# Altium project RK3568_train.PrjPcb (part 2 of 6)

## Sheet RK809-5.schdoc: =
size A3; Symbol: Sheet-Symbol_A4; Company: 嘉立创EDA; Version: V1.0; Page Size: A4; @Project Name: RK3568B2地瓜派; @Page Count: 27; @Update Date: 2025-09-11; @Create Date: 2025-09-11; @Schematic Name: Schematic1; @Page No: 14; @Page Name: RK809-5; Device: Sheet-Symbol_A4; Border: 1; Title Block Position: 3; Width: 1655; Height: 1170; Region Start: 1; X Region Count: 6; Y Region Count: 4; Blade Width: 10; @Board Name: Board1; @Create Time: 22:14:45; @Update Time: 22:15:05; Organization: ORGANIZATION; Address1: ADDRESS 1; Address2: ADDRESS 2; Address3: ADDRESS 3; Address4: ADDRESS 4; Revision: V1.0.0; SheetNumber: 6; SheetTotal: 28
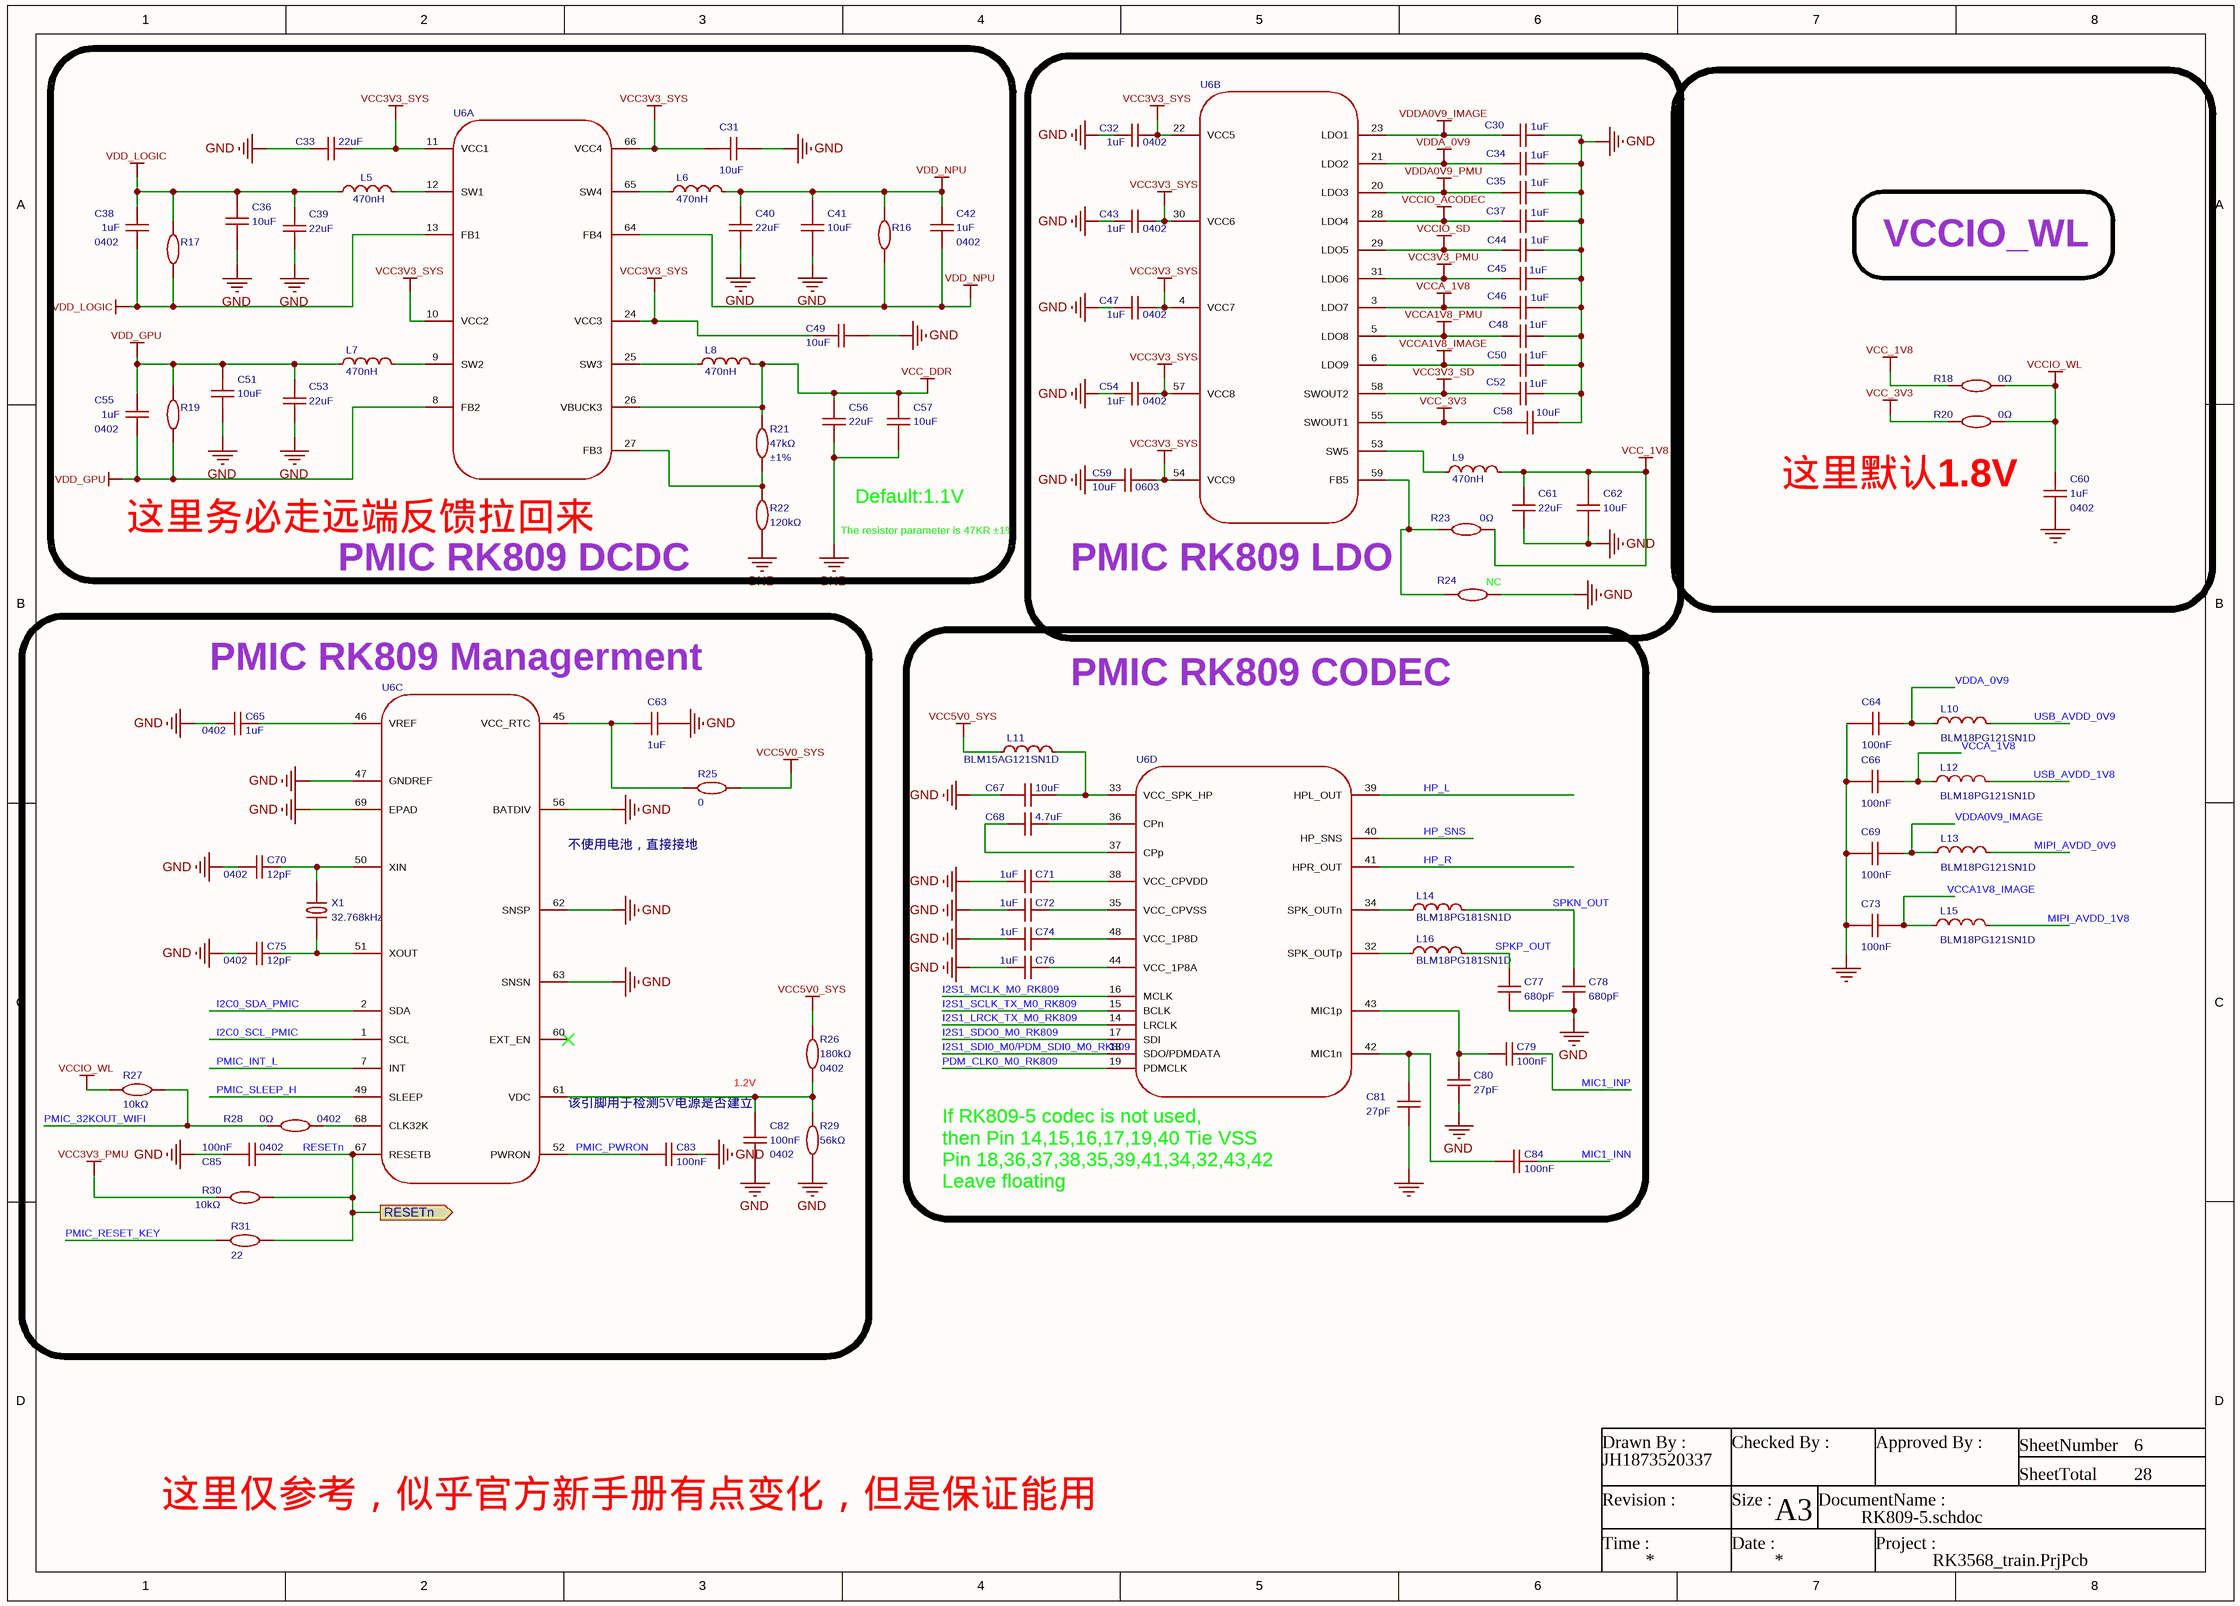
[diagram p5: RK809-5.schdoc]

### Parts
C30  1uF  [MYC0402]
C31  10uF  [C0603]
C32  1uF  Supplier Footprint: 0402  [MYC0402]
C33  22uF  [C0603]
C34  1uF  [MYC0402]
C35  1uF  [MYC0402]
C36  10uF  [C0603]
C37  1uF  [MYC0402]
C38  1uF  Supplier Footprint: 0402  [MYC0402]
C39  22uF  [C0603]
C40  22uF  [C0603]
C41  10uF  [C0603]
C42  1uF  Supplier Footprint: 0402  [MYC0402]
C43  1uF  Supplier Footprint: 0402  [MYC0402]
C44  1uF  [MYC0402]
C45  1uF  [MYC0402]
C46  1uF  [MYC0402]
C47  1uF  Supplier Footprint: 0402  [MYC0402]
C48  1uF  [MYC0402]
C49  10uF  [C0603]
C50  1uF  [MYC0402]
C51  10uF  [C0603]
C52  1uF  [MYC0402]
C53  22uF  [C0603]
C54  1uF  Supplier Footprint: 0402  [MYC0402]
C55  1uF  Supplier Footprint: 0402  [MYC0402]
C56  22uF  [C0603]
C57  10uF  [C0603]
C58  10uF  [C0603]
C59  10uF  Supplier Footprint: 0603  [C0603]
C60  1uF  Supplier Footprint: 0402  [MYC0402]
C61  22uF  [C0603]
C62  10uF  [C0603]
C63  1uF  [MYC0402]
C64  100nF  [MYC0402]
C65  1uF  Supplier Footprint: 0402  [MYC0402]
C66  100nF  [MYC0402]
C67  10uF  [MYC0402]
C68  4.7uF  [MYC0402]
C69  100nF  [MYC0402]
C70  12pF  Supplier Footprint: 0402  [MYC0402]
C71  1uF  [MYC0402]
C72  1uF  [MYC0402]
C73  100nF  [MYC0402]
C74  1uF  [MYC0402]
C75  12pF  Supplier Footprint: 0402  [MYC0402]
C76  1uF  [MYC0402]
C77  680pF  [R0402]
C78  680pF  [R0402]
C79  100nF  [MYC0402]
C80  27pF  [R0402]
C81  27pF  [R0402]
C82  100nF  Supplier Footprint: 0402  [MYC0402]
C83  100nF  [MYC0402]
C84  100nF  [MYC0402]
C85  100nF  Supplier Footprint: 0402  [MYC0402]
L5  470nH  [IND-SMD_L2.0-W1.6_MHCHL201610A-1R0M-Q8A]
L6  470nH  [IND-SMD_L2.0-W1.6_MHCHL201610A-1R0M-Q8A]
L7  470nH  [IND-SMD_L2.0-W1.6_MHCHL201610A-1R0M-Q8A]
L8  470nH  [IND-SMD_L2.0-W1.6_MHCHL201610A-1R0M-Q8A]
L9  470nH  [IND-SMD_L2.0-W1.6_MHCHL201610A-1R0M-Q8A]
L10  BLM18PG121SN1D  [L0603]
L11  BLM15AG121SN1D  [L0402]
L12  BLM18PG121SN1D  [L0603]
L13  BLM18PG121SN1D  [L0603]
L14  BLM18PG181SN1D  [L0603]
L15  BLM18PG121SN1D  [L0603]
L16  BLM18PG181SN1D  [L0603]
R16  0402WGF1000TCE  [R0402]  (value not drawn)
R17  0402WGF1000TCE  [R0402]  (value not drawn)
R18  0Ω  [R0402]
R19  0402WGF1000TCE  [R0402]  (value not drawn)
R20  0Ω  [R0402]  (no BOM)
R21  47kΩ  Tolerance: ±1%  [R0402]
R22  120kΩ  [R0402]
R23  0Ω  [R0402]
R24  NC  [R0402]  (no BOM)
R25  0  [R0402]
R26  180kΩ  Supplier Footprint: 0402  [R0402]
R27  10kΩ  [R0402]
R28  0Ω  Supplier Footprint: 0402  [R0402]
R29  56kΩ  [R0402]
R30  10kΩ  [R0402]
R31  22  [R0402]
U6  (no value)  [RK809-5]  (parts A,B,C,D of 4)
X1  32.768kHz  [CRYSTAL-SMD_L3.2-W1.5-1]

### Blocks framed on the sheet
PMIC RK809 LDO: C30 C32 C34 C35 C37 C43-C48 C50 C52 C54 C58 C59 C61 C62 L9 R23 R24 U6
PMIC RK809 Managerment: C63 C65 C70 C75 C82 C83 C85 R25-R31 U6 X1
PMIC RK809 CODEC: C67 C68 C71 C72 C74 C76-C81 C84 L11 L14 L16 U6

### Ports
RESETn (out)

### Nets
GND: C30.2 C31.2 C32.1 C33.1 C34.2 C35.2 C36.1 C37.2 C39.2 C40.2 C41.1 C43.1 C44.2 C45.2 C46.2 C47.1 C48.2 C49.1 C50.2 C51.1 C52.2 C53.2 C54.1 C56.2 C57.1 C58.2 C59.1 C60.1 C61.2 C62.1 C63.2 C64.1 C65.1 C66.1 C67.1 C69.1 C70.1 C71.1 C72.1 C73.1 C74.1 C75.2 C76.1 C77.1 C78.1 C80.1 C81.1 C82.1 C83.2 C85.1 R22.1 R24.2 R29.1 U6.47(GNDREF) U6.56(BATDIV) U6.62(SNSP) U6.63(SNSN) U6.69(EPAD)
MIPI_AVDD_0V9: L13.2
MIPI_AVDD_1V8: L15.2
USB_AVDD_0V9: L10.2
USB_AVDD_1V8: L12.2
VCC3V3_PMU: C45.1 R30.1 U6.31(LDO6)
VCC3V3_SD: C52.1 U6.58(SWOUT2)
VCC3V3_SYS: C31.1 C32.2 C33.2 C43.2 C47.2 C49.2 C54.2 C59.2 U6.4(VCC7) U6.10(VCC2) U6.11(VCC1) U6.22(VCC5) U6.24(VCC3) U6.30(VCC6) U6.54(VCC9) U6.57(VCC8) U6.66(VCC4)
VCC5V0_SYS: L11.1 R25.2 R26.2
VCC_1V8: C61.1 C62.2 L9.2 R18.1 R23.2  [project net LCD_1V8]
VCC_3V3: C58.1 R20.1 U6.55(SWOUT1)  [project net TP_3V3]
VCC_DDR: C56.1 C57.2 L8.2 R21.1 U6.26(VBUCK3)
VCCA1V8_IMAGE: C50.1 C73.2 L15.1 U6.6(LDO9)
VCCA1V8_PMU: C48.1 U6.5(LDO8)
VCCA_1V8: C46.1 C66.2 L12.1 U6.3(LDO7)
VCCIO_ACODEC: C37.1 U6.28(LDO4)
VCCIO_SD: C44.1 U6.29(LDO5)
VCCIO_WL: C60.2 R18.2 R20.2 R27.1
VDD_GPU: C51.2 C53.1 C55.1 C55.2 L7.1 R19.1 R19.2 U6.8(FB2)
VDD_LOGIC: C36.2 C38.1 C38.2 C39.1 L5.1 R17.1 R17.2 U6.13(FB1)
VDD_NPU: C40.1 C41.2 C42.1 C42.2 L6.2 R16.1 R16.2 U6.64(FB4)
VDDA0V9_IMAGE: C30.1 C69.2 L13.1 U6.23(LDO1)
VDDA0V9_PMU: C35.1 U6.20(LDO3)
VDDA_0V9: C34.1 C64.2 L10.1 U6.21(LDO2)
HP_L: U6.39(HPL_OUT)
HP_R: U6.41(HPR_OUT)
HP_SNS: U6.40(HP_SNS)
I2C0_SCL_PMIC: U6.1(SCL)
I2C0_SDA_PMIC: U6.2(SDA)
I2S1_LRCK_TX_M0_RK809: U6.14(LRCLK)
I2S1_MCLK_M0_RK809: U6.16(MCLK)
I2S1_SCLK_TX_M0_RK809: U6.15(BCLK)
I2S1_SDI0_M0/PDM_SDI0_M0_RK809: U6.18(SDO/PDMDATA)
I2S1_SDO0_M0_RK809: U6.17(SDI)
MIC1_INN: C84.2
MIC1_INP: C79.2
PDM_CLK0_M0_RK809: U6.19(PDMCLK)
PMIC_32KOUT_WIFI: R27.2 R28.1
PMIC_INT_L: U6.7(INT)
PMIC_PWRON: C83.1 U6.52(PWRON)
PMIC_RESET_KEY: R31.1
PMIC_SLEEP_H: U6.49(SLEEP)
RESETn: C85.2 R30.2 R31.2 U6.67(RESETB) ; port RESETn
SPKN_OUT: C78.2 L14.2
SPKP_OUT: C77.2 L16.2
NetC63_1: C63.1 R25.1 U6.45(VCC_RTC)
NetC65_2: C65.2 U6.46(VREF)
NetC67_2: C67.2 L11.2 U6.33(VCC_SPK_HP)
NetC68_1: C68.1 U6.36(CPn)
NetC68_2: C68.2 U6.37(CPp)
NetC70_2: C70.2 U6.50(XIN) X1.2
NetC71_2: C71.2 U6.38(VCC_CPVDD)
NetC72_2: C72.2 U6.35(VCC_CPVSS)
NetC74_2: C74.2 U6.48(VCC_1P8D)
NetC75_1: C75.1 U6.51(XOUT) X1.1
NetC76_2: C76.2 U6.44(VCC_1P8A)
NetC79_1: C79.1 C80.2 U6.43(MIC1p)
NetC81_2: C81.2 C84.1 U6.42(MIC1n)
NetC82_2: C82.2 R26.1 R29.2 U6.61(VDC)
NetL5_2: L5.2 U6.12(SW1)
NetL6_1: L6.1 U6.65(SW4)
NetL7_2: L7.2 U6.9(SW2)
NetL8_1: L8.1 U6.25(SW3)
NetL9_1: L9.1 U6.53(SW5)
NetL14_1: L14.1 U6.34(SPK_OUTn)
NetL16_1: L16.1 U6.32(SPK_OUTp)
NetR21_2: R21.2 R22.2 U6.27(FB3)
NetR23_1: R23.1 R24.1 U6.59(FB5)
NetR28_2: R28.2 U6.68(CLK32K)

Not connected (* = marked no-connect by the designer): U6 60(EXT_EN)*

### Notes on the sheet
- VCCIO_WL
- 这里默认1.8V
- (near U6) 这里务必走远端反馈拉回来
- The resistor parameter is 47KR ±1%
- Default:1.1V
- PMIC RK809 DCDC
- (near U6) 不使用电池，直接接地
- 该引脚用于检测5V电源是否建立
- (near C82) 1.2V
- If RK809-5 codec is not used,
  then Pin 14,15,16,17,19,40 Tie VSS
  Pin 18,36,37,38,35,39,41,34,32,43,42
  Leave floating
- 这里仅参考，似乎官方新手册有点变化，但是保证能用
- Drawn By :
- Checked By :
- Approved By :
- SheetNumber
- SheetTotal
- Revision :
- Time :
- Size :
- Date :
- A3
- DocumentName :
- Project :

### Library data of the parts
C30 C32 C34 C35 C37 C38 C42-C48 C50 C52 C54 C55 C60 C63 C65 C71 C72 C74 C76 = CL05A105KP5NNNC: 容值:1uF;精度:±10%;额定电压:10V;材质(温度系数):X5R;; Manufacturer: SAMSUNG(三星); AddInBom: yes; ModelId: 36a51122f27c49738f86b3bfa98863e0; ModelName: C0402_L1.0-W0.5-H0.5; ModelTransform: 39.37,19.685,0,0,0,0,0,0,0; Tolerance: ±10%; Voltage Rated: 10V; Temperature Coefficient: X5R; Device: CL05A105KP5NNNC; Symbol: CL05A105KP5NNNC; LCSC Part Name: 1uF ±10% 10V; SupplierPart: C14445; ManufacturerPart: CL05A105KP5NNNC; JLCPCB Part Class: 扩展库; Datasheet: https://atta.szlcsc.com/upload/public/pdf/source/20160103/1457707670698.pdf; Supplier: LCSC; ConvertToPcb: yes; FootprintName: MYC0402; Value: 1uF
  C30 C34 C35 C37 C44-C46 C48 C50 C52 C63 C71 C72 C74 C76: Supplier Footprint: 0402
C31 = CAP_0603: as C4 on sheet DCDC; Device: CAP_0603; Value: 10uF; AddInBom: yes; Supplier Footprint: 0603; FootprintName: C0603
C33 C39 C40 C53 C56 C61 = CL10A226MQ8NRNC: as C25 on sheet DCDC; Supplier Footprint: 0603; Device: CL10A226MQ8NRNC; LCSC Part Name: 22uF ±20% 6.3V; SupplierPart: C59461; ManufacturerPart: CL10A226MQ8NRNC; JLCPCB Part Class: Basic Part; Datasheet: https://atta.szlcsc.com/upload/public/pdf/source/20160218/1457707763339.pdf; Supplier: LCSC; ConvertToPcb: yes; FootprintName: C0603; Value: 22uF
C36 C41 C49 C51 C57-C59 C62 = CL10A106KP8NNNC: as C23 on sheet DCDC; Device: CL10A106KP8NNNC; LCSC Part Name: 10uF ±10% 10V; SupplierPart: C19702; ManufacturerPart: CL10A106KP8NNNC; JLCPCB Part Class: Basic Part; Datasheet: https://atta.szlcsc.com/upload/public/pdf/source/20160103/1457707703378.pdf; Supplier: LCSC; ConvertToPcb: yes; FootprintName: C0603; Value: 10uF
  C36 C41 C49 C51 C57 C58 C62: Supplier Footprint: 0603
C64 C66 C69 C73 = CAP_0402: Symbol: CapAcitance; ConvertToPcb: yes; ModelId: 36a51122f27c49738f86b3bfa98863e0; ModelName: C0402_L1.0-W0.5-H0.5; ModelTransform: 39.37,19.685,0,0,0,0,0,0,0; Device: CAP_0402; AddInBom: yes; Supplier Footprint: 0402; FootprintName: MYC0402; Value: 100nF
C67 = CL05A106MQ5NUNC: 容值:10uF;精度:±20%;额定电压:6.3V;材质(温度系数):X5R;; Manufacturer: SAMSUNG(三星); Symbol: 0603X106M100; AddInBom: yes; ModelId: 36a51122f27c49738f86b3bfa98863e0; ModelName: C0402_L1.0-W0.5-H0.5; ModelTransform: 39.37,19.685,0,0,0,0,0,0,0; Tolerance: ±20%; Voltage Rated: 6.3V; Temperature Coefficient: X5R; JLCPCB Part Class: Basic Part; Device: CL05A106MQ5NUNC; LCSC Part Name: 10uF ±20% 6.3V; SupplierPart: C15525; ManufacturerPart: CL05A106MQ5NUNC; Supplier Footprint: 0402; Datasheet: https://atta.szlcsc.com/upload/public/pdf/source/20220823/2B02EE04F8F211D38A52DCB16EB6BEBA.pdf; Supplier: LCSC; ConvertToPcb: yes; FootprintName: MYC0402; Value: 10uF
C68 = CL05A475MQ5NRNC: 容值:4.7uF;精度:±20%;额定电压:6.3V;材质(温度系数):X5R;; Manufacturer: SAMSUNG(三星); Symbol: CL10A475KO8NNNC; AddInBom: yes; ModelId: 36a51122f27c49738f86b3bfa98863e0; ModelName: C0402_L1.0-W0.5-H0.5; ModelTransform: 39.37,19.685,0,0,0,0,0,0,0; Tolerance: ±20%; Voltage Rated: 6.3V; Temperature Coefficient: X5R; Device: CL05A475MQ5NRNC; LCSC Part Name: 4.7uF ±20% 6.3V; SupplierPart: C307423; ManufacturerPart: CL05A475MQ5NRNC; Supplier Footprint: 0402; JLCPCB Part Class: Extended Part; Datasheet: https://atta.szlcsc.com/upload/public/pdf/source/20181010/C307423_0E0C4E35F3A09F81C2E5C84E00499E42.pdf; Supplier: LCSC; ConvertToPcb: yes; FootprintName: MYC0402; Value: 4.7uF
C70 C75 = 0402CG120J500NT: 容值:12pF;精度:±5%;额定电压:50V;材质(温度系数):C0G;; Manufacturer: FH(风华); Symbol: 0402CG220J500NT; AddInBom: yes; ModelId: 36a51122f27c49738f86b3bfa98863e0; ModelName: C0402_L1.0-W0.5-H0.5; ModelTransform: 39.37,19.685,0,0,0,0,0,0,0; Tolerance: ±5%; Voltage Rated: 50V; Temperature Coefficient: C0G; Datasheet: https://atta.szlcsc.com/upload/public/pdf/source/20200305/C486355_26A10D38EF8C2A5C37091D0039909270.pdf; Device: 0402CG120J500NT; LCSC Part Name: 12pF ±5% 50V; SupplierPart: C1547; ManufacturerPart: 0402CG120J500NT; JLCPCB Part Class: Basic Part; Supplier: LCSC; ConvertToPcb: yes; FootprintName: MYC0402; Value: 12pF
C77 C78 = 0402B681K500NT: 容值:680pF;精度:±10%;额定电压:50V;材质(温度系数):X7R;; Manufacturer: FH(风华); AddInBom: yes; ModelId: 36a51122f27c49738f86b3bfa98863e0; ModelName: C0402_L1.0-W0.5-H0.5; ModelTransform: 39.37,19.685,0,0,0,0,0,0,0; Tolerance: ±10%; Voltage Rated: 50V; Temperature Coefficient: X7R; Device: 0402B681K500NT; Symbol: 0402B681K500NT; LCSC Part Name: 680pF ±10% 50V; SupplierPart: C1541; ManufacturerPart: 0402B681K500NT; Supplier Footprint: 0402; JLCPCB Part Class: Extended Part; Datasheet: https://atta.szlcsc.com/upload/public/pdf/source/20170923/C1541_1506149263051988348.pdf; Supplier: LCSC; ConvertToPcb: yes; FootprintName: R0402; Value: 680pF
C79 C84 = CL05B104KO5NNNC: 容值:100nF;精度:±10%;额定电压:16V;材质(温度系数):X7R;; Manufacturer: SAMSUNG(三星); AddInBom: yes; ModelId: 36a51122f27c49738f86b3bfa98863e0; ModelName: C0402_L1.0-W0.5-H0.5; ModelTransform: 39.37,19.685,0,0,0,0,0,0,0; Tolerance: ±10%; Voltage Rated: 16V; Temperature Coefficient: X7R; Device: CL05B104KO5NNNC; Symbol: CL05B104KO5NNNC; LCSC Part Name: 100nF ±10% 16V; SupplierPart: C1525; ManufacturerPart: CL05B104KO5NNNC; Supplier Footprint: 0402; JLCPCB Part Class: 基础库; Datasheet: https://atta.szlcsc.com/upload/public/pdf/source/20160103/1457707674891.pdf; Supplier: LCSC; ConvertToPcb: yes; FootprintName: MYC0402; Value: 100nF
C80 C81 = 0402CG270J500NT: 容值:27pF;精度:±5%;额定电压:50V;材质(温度系数):C0G;; Manufacturer: FH(风华); Symbol: 0402CG270J500NTN; AddInBom: yes; ModelId: 36a51122f27c49738f86b3bfa98863e0; ModelName: C0402_L1.0-W0.5-H0.5; ModelTransform: 39.37,19.685,0,0,0,0,0,0,0; Tolerance: ±5%; Voltage Rated: 50V; Temperature Coefficient: C0G; Device: 0402CG270J500NT; LCSC Part Name: 27pF ±5% 50V; SupplierPart: C1557; ManufacturerPart: 0402CG270J500NT; Supplier Footprint: 0402; JLCPCB Part Class: Basic Part; Datasheet: https://atta.szlcsc.com/upload/public/pdf/source/20170923/C1557_1506149270123988364.pdf; Supplier: LCSC; ConvertToPcb: yes; FootprintName: R0402; Value: 27pF
C82 C83 C85 = CL05B104KB54PNC: as C21 on sheet DCDC; Symbol: CL05B104KB54PNC; Device: CL05B104KB54PNC; LCSC Part Name: 100nF ±10% 50V; SupplierPart: C307331; ManufacturerPart: CL05B104KB54PNC; JLCPCB Part Class: Basic Part; Datasheet: https://atta.szlcsc.com/upload/public/pdf/source/20181009/C307331_222F7C870FD3EA5F46F538B483443886.pdf; Supplier: LCSC; ConvertToPcb: yes; FootprintName: MYC0402; Value: 100nF
  C83: Supplier Footprint: 0402
L5-L9 = MCS20FC-R47MHC: 电感值:470nH;精度:±20%;额定电流:4.05A;; Manufacturer: PSA(信昌电陶); AddInBom: yes; ModelId: 668c12c5c4cf45ec81ccaa044c30b915; ModelTransform: 79.527,63.7794,0,0,0,0,0,0,0; Tolerance: ±20%; Rated Current: 4.05A; DC Resistance (DCR): 23mΩ; Device: MCS20FC-R47MHC; Symbol: MCS20FC-R47MHC; LCSC Part Name: 470nH ±20% 4.05A 23mΩ; SupplierPart: C375941; ManufacturerPart: MCS20FC-R47MHC; Supplier Footprint: SMD; JLCPCB Part Class: 扩展库; Datasheet: https://atta.szlcsc.com/upload/public/pdf/source/20190312/C375941_0FA6931C341ECE1823B3912EFF81D587.pdf; Supplier: LCSC; ConvertToPcb: yes; FootprintName: IND-SMD_L2.0-W1.6_MHCHL201610A-1R0M-Q8A; ModelName: IND-SMD_L2.0-W1.6_MHCHL201610A-1R0M-Q8A; Value: 470nH
L10 L12 L13 L15 = BLM18PG121SN1D: 标称阻抗@测试频率:120Ω@100MHz;误差:±25%;直流电阻(RDC):50mΩ;; Manufacturer: muRata(村田); Symbol: BLM18PG121SN1D_C14709; AddInBom: yes; ModelId: 2bc5ec593d464d6ba9807aec0b5673c2; ModelName: L0603_L1.6-W0.8-H0.5_BEAD; ModelTransform: 62.992,31.496,0,180,0,0,0.094,0.629,0; Tolerance: ±25%; DC Resistance: 50mΩ; Current Rating: 2A; Circuits: 1; Device: BLM18PG121SN1D; LCSC Part Name: 单路 0603磁珠 阻抗120Ω@100MHz; SupplierPart: C14709; ManufacturerPart: BLM18PG121SN1D; Supplier Footprint: 0603; JLCPCB Part Class: 基础库; Datasheet: https://atta.szlcsc.com/upload/public/pdf/source/20130704/1457706621422.pdf; Supplier: LCSC; ConvertToPcb: yes; FootprintName: L0603; Impedance @ Frequency: 120Ω@100MHz
L11 = BLM15AG121SN1D: 标称阻抗@测试频率:120Ω@100MHz;误差:±25%;直流电阻(RDC):250mΩ;额定电流:500mA;电路数:1;; Manufacturer: muRata(村田); Symbol: CBM160808U121T; AddInBom: yes; ModelId: d8d36575a3234d4790bfa765c88664a7; ModelName: L0402_L1.0-W0.5-H0.5_BEAD; ModelTransform: 39.37,19.685,0,0,0,0,0,0.0005,0; Tolerance: ±25%; DC Resistance: 250mΩ; Current Rating: 500mA; Circuits: 1; Device: BLM15AG121SN1D; LCSC Part Name: 120Ω@100MHz ±25%; SupplierPart: C85812; ManufacturerPart: BLM15AG121SN1D; Supplier Footprint: 0402; JLCPCB Part Class: Extended Part; Datasheet: https://atta.szlcsc.com/upload/public/pdf/source/20180326/C85812_709B7ABD18A92BCC8FFBD7A231EEE264.pdf; Supplier: LCSC; ConvertToPcb: yes; FootprintName: L0402; Impedance @ Frequency: 120Ω@100MHz
L14 L16 = BLM18PG181SN1D: 标称阻抗@测试频率:180Ω@100MHz;误差:±25%;直流电阻(RDC):90mΩ;额定电流:1.5A;电路数:1;; Manufacturer: muRata(村田); AddInBom: yes; ModelId: 2bc5ec593d464d6ba9807aec0b5673c2; ModelName: L0603_L1.6-W0.8-H0.5_BEAD; ModelTransform: 62.992,31.496,0,180,0,0,0.094,0.629,0; Tolerance: ±25%; DC Resistance: 90mΩ; Current Rating: 1.5A; Circuits: 1; Device: BLM18PG181SN1D; Symbol: BLM18PG181SN1D; LCSC Part Name: 180Ω@100MHz ±25%; SupplierPart: C82850; ManufacturerPart: BLM18PG181SN1D; Supplier Footprint: 0603; JLCPCB Part Class: Extended Part; Datasheet: https://atta.szlcsc.com/upload/public/pdf/source/20180326/C82850_BC876320DC99E3923AFD377E2F9C4AED.pdf; Supplier: LCSC; ConvertToPcb: yes; FootprintName: L0603; Impedance @ Frequency: 180Ω@100MHz
R16 R17 R19 = 0402WGF1000TCE: Manufacturer: UNI-ROYAL(厚声); ConvertToPcb: yes; ModelId: 671aefced39d4c318694bba8bd8efd39; ModelName: R0402_L1.0-W0.5-H0.5; ModelTransform: 39.37,19.685,0,0,0,0,0,0.0005,0; LCSC Part Name: 100Ω(1000) ±1% 编带; Device: 0402WGF1000TCE; Symbol: 0402WGF1000TCE; AddInBom: yes; Supplier: LCSC; SupplierPart: C25076; Supplier Footprint: 0402; JLCPCB Part Class: Basic Part; Datasheet: https://atta.szlcsc.com/upload/public/pdf/source/20170920/C25076_1505901197574982707.pdf; ManufacturerPart: 0402WGF1000TCE; FootprintName: R0402
R18 R23 R28 = ERJ2GE0R00X: 电阻类型:-;阻值:0Ω;功率:100mW;温度系数:-100ppm/℃~+600ppm/℃;最大工作电压:-;工作温度范围:-55℃~+155℃;; Manufacturer: PANASONIC(松下); AddInBom: yes; ModelId: 671aefced39d4c318694bba8bd8efd39; ModelName: R0402_L1.0-W0.5-H0.5; ModelTransform: 39.37,19.685,0,0,0,0,0,0.0005,0; Power(Watts): 100mW; Device: ERJ2GE0R00X; Symbol: ERJ2GE0R00X; LCSC Part Name: 0Ω 100mW; SupplierPart: C242160; ManufacturerPart: ERJ2GE0R00X; JLCPCB Part Class: 扩展库; Datasheet: https://atta.szlcsc.com/upload/public/pdf/source/20181106/C242160_CA6E41971DE5A1DCD79442F3CF334CD6.pdf; Supplier: LCSC; ConvertToPcb: yes; FootprintName: R0402; Type: -; Value: 0Ω; Temperature Coefficient: -100ppm/℃~+600ppm/℃; Overload Voltage (Max): -; Operating Temperature Range: -55℃~+155℃
  R18 R23: Supplier Footprint: 0402
R20 = ERJ2GE0R00X: 电阻类型:-;阻值:0Ω;功率:100mW;温度系数:-100ppm/℃~+600ppm/℃;最大工作电压:-;工作温度范围:-55℃~+155℃;; Manufacturer: PANASONIC(松下); Convert to PCB: yes; Add into BOM: no; ModelId: 671aefced39d4c318694bba8bd8efd39; ModelName: R0402_L1.0-W0.5-H0.5; ModelTransform: 39.37,19.685,0,0,0,0,0,0.0005,0; Power(Watts): 100mW; Device: ERJ2GE0R00X; Symbol: ERJ2GE0R00X; LCSC Part Name: 0Ω 100mW; SupplierPart: C242160; ManufacturerPart: ERJ2GE0R00X; Supplier Footprint: 0402; JLCPCB Part Class: 扩展库; Datasheet: https://atta.szlcsc.com/upload/public/pdf/source/20181106/C242160_CA6E41971DE5A1DCD79442F3CF334CD6.pdf; Supplier: LCSC; FootprintName: R0402; Type: -; Value: 0Ω; Temperature Coefficient: -100ppm/℃~+600ppm/℃; Overload Voltage (Max): -; Operating Temperature Range: -55℃~+155℃
R21 = 0402WGF4702TCE: 电阻类型:厚膜电阻;阻值:47kΩ;精度:±1%;功率:62.5mW;温度系数:±100ppm/℃;最大工作电压:50V;工作温度范围:-55℃~+155℃;; Manufacturer: UNI-ROYAL(厚声); AddInBom: yes; ModelId: 671aefced39d4c318694bba8bd8efd39; ModelName: R0402_L1.0-W0.5-H0.5; ModelTransform: 39.37,19.685,0,0,0,0,0,0.0005,0; Power(Watts): 62.5mW; Overload Voltage (Max): 50V; Device: 0402WGF4702TCE; Symbol: 0402WGF4702TCE; LCSC Part Name: 47kΩ ±1% 62.5mW; SupplierPart: C25792; ManufacturerPart: 0402WGF4702TCE; Supplier Footprint: 0402; JLCPCB Part Class: Basic Part; Datasheet: https://atta.szlcsc.com/upload/public/pdf/source/20200306/C422600_1E6D84923E4A46A82E41ADD87F860B5C.pdf; Supplier: LCSC; ConvertToPcb: yes; FootprintName: R0402; Type: 厚膜电阻; Value: 47kΩ; Temperature Coefficient: ±100ppm/℃; Operating Temperature Range: -55℃~+155℃
R22 = 0402WGF1203TCE: 电阻类型:厚膜电阻;阻值:120kΩ;精度:±1%;功率:62.5mW;温度系数:±100ppm/℃;最大工作电压:50V;工作温度范围:-55℃~+155℃;; Manufacturer: UNI-ROYAL(厚声); AddInBom: yes; ModelId: 671aefced39d4c318694bba8bd8efd39; ModelName: R0402_L1.0-W0.5-H0.5; ModelTransform: 39.37,19.685,0,0,0,0,0,0.0005,0; Tolerance: ±1%; Power(Watts): 62.5mW; Overload Voltage (Max): 50V; Device: 0402WGF1203TCE; Symbol: 0402WGF1203TCE; LCSC Part Name: 120kΩ ±1% 62.5mW; SupplierPart: C25750; ManufacturerPart: 0402WGF1203TCE; Supplier Footprint: 0402; JLCPCB Part Class: Basic Part; Datasheet: https://atta.szlcsc.com/upload/public/pdf/source/20200306/C422600_1E6D84923E4A46A82E41ADD87F860B5C.pdf; Supplier: LCSC; ConvertToPcb: yes; FootprintName: R0402; Type: 厚膜电阻; Value: 120kΩ; Temperature Coefficient: ±100ppm/℃; Operating Temperature Range: -55℃~+155℃
R24 = ERJ2GE0R00X: 电阻类型:-;阻值:0Ω;功率:100mW;温度系数:-100ppm/℃~+600ppm/℃;最大工作电压:-;工作温度范围:-55℃~+155℃;; Manufacturer: PANASONIC(松下); Convert to PCB: no; ModelId: 671aefced39d4c318694bba8bd8efd39; ModelName: R0402_L1.0-W0.5-H0.5; ModelTransform: 39.37,19.685,0,0,0,0,0,0.0005,0; Power(Watts): 100mW; Supplier Part: NC; Value: NC; Device: ERJ2GE0R00X; Add into BOM: no; Symbol: ERJ2GE0R00X; LCSC Part Name: 0Ω 100mW; ManufacturerPart: ERJ2GE0R00X; Supplier Footprint: 0402; JLCPCB Part Class: 扩展库; Datasheet: https://atta.szlcsc.com/upload/public/pdf/source/20181106/C242160_CA6E41971DE5A1DCD79442F3CF334CD6.pdf; Supplier: LCSC; FootprintName: R0402; Type: -; Temperature Coefficient: -100ppm/℃~+600ppm/℃; Overload Voltage (Max): -; Operating Temperature Range: -55℃~+155℃
R25 = Res_0402: as R4 on sheet DCDC; Device: Res_0402; Supplier Footprint: 0402; Value: 0; AddInBom: yes; FootprintName: R0402
R26 = RC0402FR-07180KL: 电阻类型:厚膜电阻;阻值:180kΩ;精度:±1%;功率:62.5mW;温度系数:±100ppm/℃;最大工作电压:50V;工作温度范围:-55℃~+155℃;; Manufacturer: YAGEO(国巨); AddInBom: yes; ModelId: 671aefced39d4c318694bba8bd8efd39; ModelName: R0402_L1.0-W0.5-H0.5; ModelTransform: 39.37,19.685,0,0,0,0,0,0.0005,0; Tolerance: ±1%; Power(Watts): 62.5mW; Overload Voltage (Max): 50V; Device: RC0402FR-07180KL; Symbol: RC0402FR-07180KL; LCSC Part Name: 180kΩ ±1% 62.5mW; SupplierPart: C138046; ManufacturerPart: RC0402FR-07180KL; JLCPCB Part Class: Extended Part; Datasheet: https://atta.szlcsc.com/upload/public/pdf/source/20171107/C138046_15100516638711096969.pdf; Supplier: LCSC; ConvertToPcb: yes; FootprintName: R0402; Type: 厚膜电阻; Value: 180kΩ; Temperature Coefficient: ±100ppm/℃; Operating Temperature Range: -55℃~+155℃
R27 R30 = CRCW040210K0FKED: 电阻类型:厚膜电阻;阻值:10kΩ;精度:±1%;功率:63mW;温度系数:±100ppm/K;最大工作电压:50V;工作温度范围:-55℃~+155℃;; Manufacturer: VISHAY(威世); AddInBom: yes; ModelId: 671aefced39d4c318694bba8bd8efd39; ModelName: R0402_L1.0-W0.5-H0.5; ModelTransform: 39.37,19.685,0,0,0,0,0,0.0005,0; Tolerance: ±1%; Power(Watts): 63mW; Overload Voltage (Max): 50V; Device: CRCW040210K0FKED; Symbol: CRCW040210K0FKED; LCSC Part Name: 10kΩ ±1% 63mW; SupplierPart: C71617; ManufacturerPart: CRCW040210K0FKED; Supplier Footprint: 0402; JLCPCB Part Class: 扩展库; Datasheet: https://atta.szlcsc.com/upload/public/pdf/source/20180224/C71617_15194370300791364062.pdf; Supplier: LCSC; ConvertToPcb: yes; FootprintName: R0402; Type: 厚膜电阻; Value: 10kΩ; Temperature Coefficient: ±100ppm/K; Operating Temperature Range: -55℃~+155℃
R29 = 0402WGF5602TCE: 精度:±1%;功率:1/16W;温度系数:±100ppm/℃;阻值:56kΩ;最大工作电压:50V;工作温度范围:-55℃~+155℃;; Manufacturer: UNI-ROYAL(厚声); AddInBom: yes; ModelId: 671aefced39d4c318694bba8bd8efd39; ModelName: R0402_L1.0-W0.5-H0.5; ModelTransform: 39.37,19.685,0,0,0,0,0,0.0005,0; Tolerance: ±1%; Power(Watts): 1/16W; Overload Voltage (Max): 50V; Device: 0402WGF5602TCE; Symbol: 0402WGF5602TCE; LCSC Part Name: 56KΩ ±1%; SupplierPart: C25796; ManufacturerPart: 0402WGF5602TCE; Supplier Footprint: 0402; JLCPCB Part Class: Basic Part; Datasheet: https://atta.szlcsc.com/upload/public/pdf/source/20170920/C25796_1505901547482983369.pdf; Supplier: LCSC; ConvertToPcb: yes; FootprintName: R0402; Temperature Coefficient: ±100ppm/℃; Value: 56kΩ; Operating Temperature Range: -55℃~+155℃
R31 = Res_0402: as R1 on sheet DCDC; Value: 22; Device: Res_0402; AddInBom: yes; Supplier Footprint: 0402; FootprintName: R0402
U6 = RK809-5: AddInBom: yes; ModelId: e930c577e1fa4bd28a96171513c1b833聨0819f05c4eef4c71ace90d822a990e87; ModelName: QFN-68_L7.0-W7.0-H0.8-P0.35-BL-EP5.5; ModelTransform: 275.59,275.59,29.527499999999996,0,0,0,-3.93701,-11.81102,0; Device: RK809-5; ConvertToPcb: yes; SymbolName: RK809-5; FootprintName: RK809-5
X1 = XKXGI-SUA-32.768K: 频率:32.768kHz;频率公差:±20ppm;负载电容:12.5pF;; Manufacturer: YXC(扬兴晶振); Equivalent Series Resistance (ESR): 70kΩ; Symbol: FC-135 32.7680KA-A; AddInBom: yes; ModelId: 762d7afc596f4558a373612390f4386d; ModelTransform: 125.984,59.055,0,0,0,0,0,0,0; Crystal Type: 贴片无源晶振; Frequency Tolerance: ±20ppm; Load Capacitance: 12.5pF; Operating Temperature: -40℃~+85℃; Frequency Stability: -; Device: XKXGI-SUA-32.768K; LCSC Part Name: 32.768kHz ±20ppm 12.5pF YST310S; SupplierPart: C5213671; ManufacturerPart: XKXGI-SUA-32.768K; Supplier Footprint: SMD3215-2P; JLCPCB Part Class: Extended Part; Datasheet: https://atta.szlcsc.com/upload/public/pdf/source/20221026/C961783E7D3E186CA8CEB40DFC46D85F.pdf; Supplier: LCSC; ConvertToPcb: yes; FootprintName: CRYSTAL-SMD_L3.2-W1.5-1; ModelName: CRYSTAL-SMD_L3.2-W1.5-1; Value: 32.768kHz

## Sheet SOC_PWR.schdoc: =
size A3; Symbol: Sheet-Symbol_A4; Company: 嘉立创EDA; Version: V1.0; Page Size: A4; @Project Name: RK3568_LPD4X_120P_Core; @Page Count: 18; @Update Date: 2025-08-22; @Create Date: 2025-08-15; @Schematic Name: Schematic1; @Page No: 4; @Page Name: SOC_PWR; Device: Sheet-Symbol_A4; Border: 1; Title Block Position: 3; Width: 1655; Height: 1170; Region Start: 1; X Region Count: 6; Y Region Count: 4; Blade Width: 10; @Board Name: Board1; @Create Time: 13:49:34; @Update Time: 16:42:04; Organization: ORGANIZATION; Address1: ADDRESS 1; Address2: ADDRESS 2; Address3: ADDRESS 3; Address4: ADDRESS 4; Revision: V1.0.0; SheetNumber: 7; SheetTotal: 28
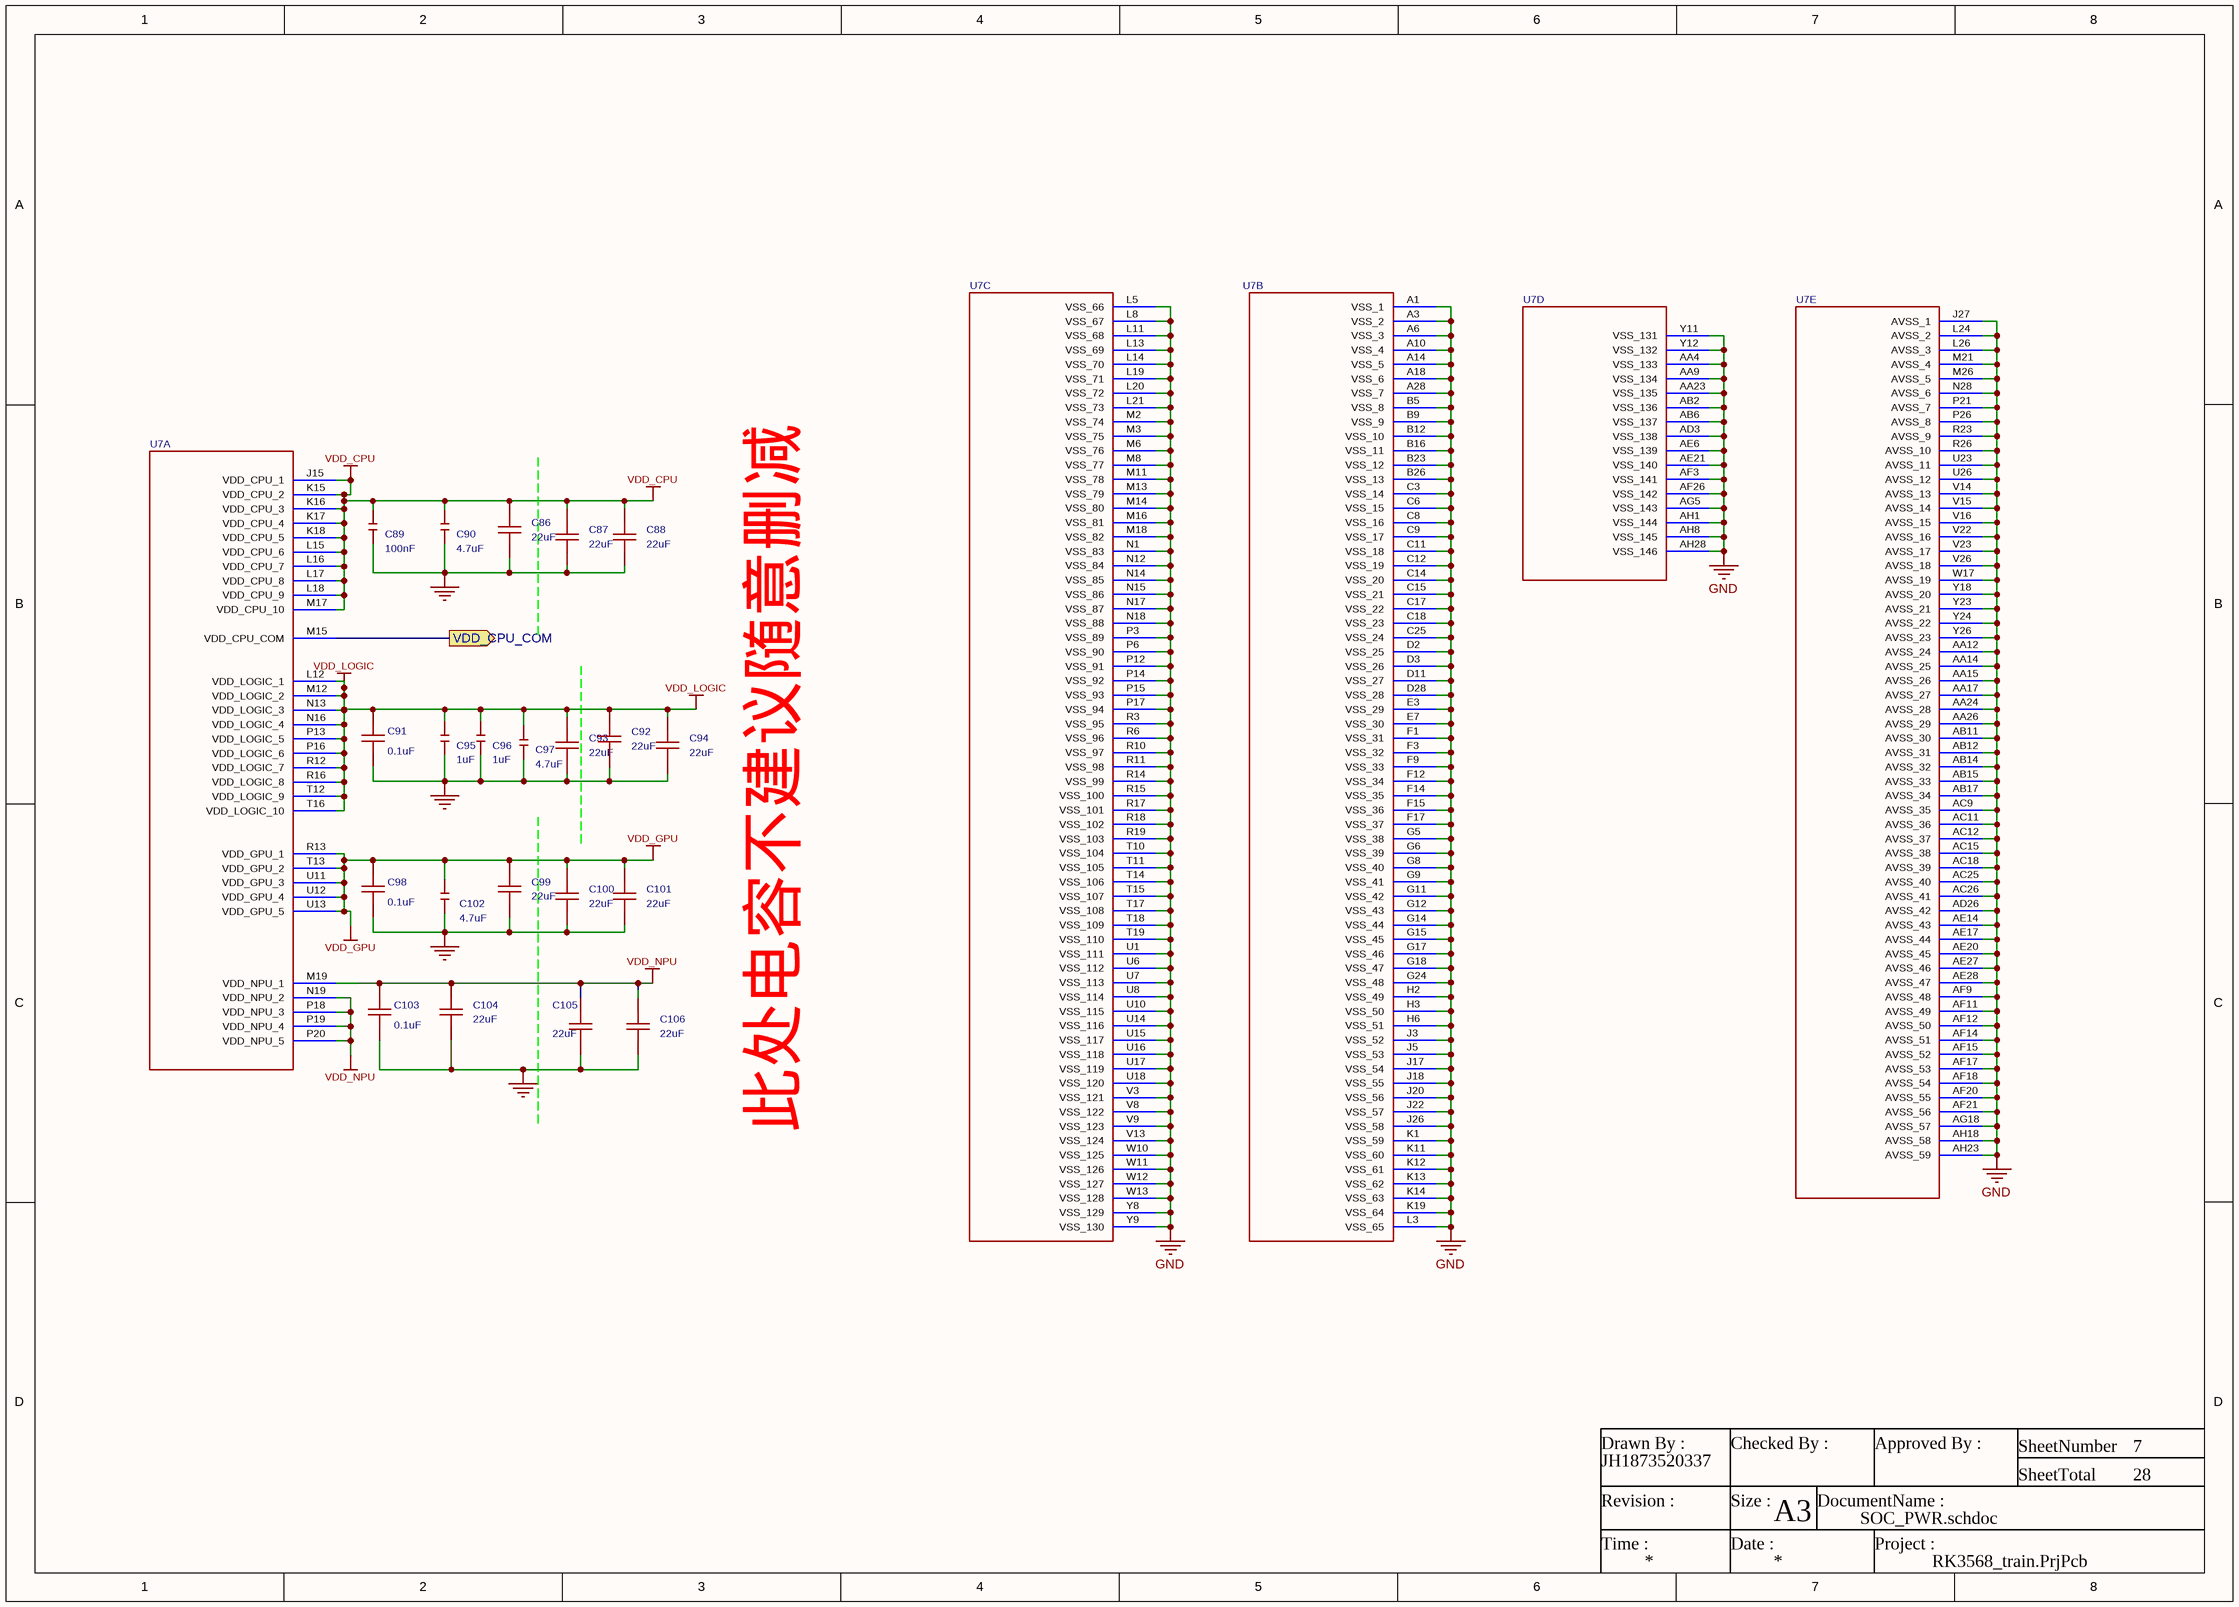
[diagram p6: SOC_PWR.schdoc]

### Parts
C86  22uF  [C0603]
C87  22uF  [C0603]
C88  22uF  [C0603]
C89  100nF  [MYC0402]
C90  4.7uF  [MYC0402]
C91  0.1uF  [C0201]
C92  22uF  [C0603]
C93  22uF  [C0603]
C94  22uF  [C0603]
C95  1uF  [MYC0402]
C96  1uF  [MYC0402]
C97  4.7uF  [MYC0402]
C98  0.1uF  [C0201]
C99  22uF  [C0603]
C100  22uF  [C0603]
C101  22uF  [C0603]
C102  4.7uF  [MYC0402]
C103  0.1uF  [C0201]
C104  22uF  [C0603]
C105  22uF  [C0603]
C106  22uF  [C0603]
U7  RK3568  [BGA-636_L19.0-W19.0-P0.65-BL]  (value not drawn)  (parts A,B,C,D,E of 23)

### Ports
VDD_CPU_COM (out)

### Nets
GND: C86.1 C87.1 C88.1 C89.1 C90.1 C91.1 C92.1 C93.1 C94.1 C95.1 C96.1 C97.1 C98.1 C99.1 C100.1 C101.1 C102.1 C103.1 C104.1 C105.1 C106.1 U7.A1(VSS_1) U7.A3(VSS_2) U7.A6(VSS_3) U7.A10(VSS_4) U7.A14(VSS_5) U7.A18(VSS_6) U7.A28(VSS_7) U7.AA4(VSS_133) U7.AA9(VSS_134) U7.AA12(AVSS_24) U7.AA14(AVSS_25) U7.AA15(AVSS_26) U7.AA17(AVSS_27) U7.AA23(VSS_135) U7.AA24(AVSS_28) U7.AA26(AVSS_29) U7.AB2(VSS_136) U7.AB6(VSS_137) U7.AB11(AVSS_30) U7.AB12(AVSS_31) U7.AB14(AVSS_32) U7.AB15(AVSS_33) U7.AB17(AVSS_34) U7.AC9(AVSS_35) U7.AC11(AVSS_36) U7.AC12(AVSS_37) U7.AC15(AVSS_38) U7.AC18(AVSS_39) U7.AC25(AVSS_40) U7.AC26(AVSS_41) U7.AD3(VSS_138) U7.AD26(AVSS_42) U7.AE6(VSS_139) U7.AE14(AVSS_43) U7.AE17(AVSS_44) U7.AE20(AVSS_45) U7.AE21(VSS_140) U7.AE27(AVSS_46) U7.AE28(AVSS_47) U7.AF3(VSS_141) U7.AF9(AVSS_48) U7.AF11(AVSS_49) U7.AF12(AVSS_50) U7.AF14(AVSS_51) U7.AF15(AVSS_52) U7.AF17(AVSS_53) U7.AF18(AVSS_54) U7.AF20(AVSS_55) U7.AF21(AVSS_56) U7.AF26(VSS_142) U7.AG5(VSS_143) U7.AG18(AVSS_57) U7.AH1(VSS_144) U7.AH8(VSS_145) U7.AH18(AVSS_58) U7.AH23(AVSS_59) U7.AH28(VSS_146) U7.B5(VSS_8) U7.B9(VSS_9) U7.B12(VSS_10) U7.B16(VSS_11) U7.B23(VSS_12) U7.B26(VSS_13) U7.C3(VSS_14) U7.C6(VSS_15) U7.C8(VSS_16) U7.C9(VSS_17) U7.C11(VSS_18) U7.C12(VSS_19) U7.C14(VSS_20) U7.C15(VSS_21) U7.C17(VSS_22) U7.C18(VSS_23) U7.C25(VSS_24) U7.D2(VSS_25) U7.D3(VSS_26) U7.D11(VSS_27) U7.D28(VSS_28) U7.E3(VSS_29) U7.E7(VSS_30) U7.F1(VSS_31) U7.F3(VSS_32) U7.F9(VSS_33) U7.F12(VSS_34) U7.F14(VSS_35) U7.F15(VSS_36) U7.F17(VSS_37) U7.G5(VSS_38) U7.G6(VSS_39) U7.G8(VSS_40) U7.G9(VSS_41) U7.G11(VSS_42) U7.G12(VSS_43) U7.G14(VSS_44) U7.G15(VSS_45) U7.G17(VSS_46) U7.G18(VSS_47) U7.G24(VSS_48) U7.H2(VSS_49) U7.H3(VSS_50) U7.H6(VSS_51) U7.J3(VSS_52) U7.J5(VSS_53) U7.J17(VSS_54) U7.J18(VSS_55) U7.J20(VSS_56) U7.J22(VSS_57) U7.J26(VSS_58) U7.J27(AVSS_1) U7.K1(VSS_59) U7.K11(VSS_60) U7.K12(VSS_61) U7.K13(VSS_62) U7.K14(VSS_63) U7.K19(VSS_64) U7.L3(VSS_65) U7.L5(VSS_66) U7.L8(VSS_67) U7.L11(VSS_68) U7.L13(VSS_69) U7.L14(VSS_70) U7.L19(VSS_71) U7.L20(VSS_72) U7.L21(VSS_73) U7.L24(AVSS_2) U7.L26(AVSS_3) U7.M2(VSS_74) U7.M3(VSS_75) U7.M6(VSS_76) U7.M8(VSS_77) U7.M11(VSS_78) U7.M13(VSS_79) U7.M14(VSS_80) U7.M16(VSS_81) U7.M18(VSS_82) U7.M21(AVSS_4) U7.M26(AVSS_5) U7.N1(VSS_83) U7.N12(VSS_84) U7.N14(VSS_85) U7.N15(VSS_86) U7.N17(VSS_87) U7.N18(VSS_88) U7.N28(AVSS_6) U7.P3(VSS_89) U7.P6(VSS_90) U7.P12(VSS_91) U7.P14(VSS_92) U7.P15(VSS_93) U7.P17(VSS_94) U7.P21(AVSS_7) U7.P26(AVSS_8) U7.R3(VSS_95) U7.R6(VSS_96) U7.R10(VSS_97) U7.R11(VSS_98) U7.R14(VSS_99) U7.R15(VSS_100) U7.R17(VSS_101) U7.R18(VSS_102) U7.R19(VSS_103) U7.R23(AVSS_9) U7.R26(AVSS_10) U7.T10(VSS_104) U7.T11(VSS_105) U7.T14(VSS_106) U7.T15(VSS_107) U7.T17(VSS_108) U7.T18(VSS_109) U7.T19(VSS_110) U7.U1(VSS_111) U7.U6(VSS_112) U7.U7(VSS_113) U7.U8(VSS_114) U7.U10(VSS_115) U7.U14(VSS_116) U7.U15(VSS_117) U7.U16(VSS_118) U7.U17(VSS_119) U7.U18(VSS_120) U7.U23(AVSS_11) U7.U26(AVSS_12) U7.V3(VSS_121) U7.V8(VSS_122) U7.V9(VSS_123) U7.V13(VSS_124) U7.V14(AVSS_13) U7.V15(AVSS_14) U7.V16(AVSS_15) U7.V22(AVSS_16) U7.V23(AVSS_17) U7.V26(AVSS_18) U7.W10(VSS_125) U7.W11(VSS_126) U7.W12(VSS_127) U7.W13(VSS_128) U7.W17(AVSS_19) U7.Y8(VSS_129) U7.Y9(VSS_130) U7.Y11(VSS_131) U7.Y12(VSS_132) U7.Y18(AVSS_20) U7.Y23(AVSS_21) U7.Y24(AVSS_22) U7.Y26(AVSS_23)
VDD_CPU: C86.2 C87.2 C88.2 C89.2 C90.2 U7.J15(VDD_CPU_1) U7.K15(VDD_CPU_2) U7.K16(VDD_CPU_3) U7.K17(VDD_CPU_4) U7.K18(VDD_CPU_5) U7.L15(VDD_CPU_6) U7.L16(VDD_CPU_7) U7.L17(VDD_CPU_8) U7.L18(VDD_CPU_9) U7.M17(VDD_CPU_10)
VDD_GPU: C98.2 C99.2 C100.2 C101.2 C102.2 U7.R13(VDD_GPU_1) U7.T13(VDD_GPU_2) U7.U11(VDD_GPU_3) U7.U12(VDD_GPU_4) U7.U13(VDD_GPU_5)
VDD_LOGIC: C91.2 C92.2 C93.2 C94.2 C95.2 C96.2 C97.2 U7.L12(VDD_LOGIC_1) U7.M12(VDD_LOGIC_2) U7.N13(VDD_LOGIC_3) U7.N16(VDD_LOGIC_4) U7.P13(VDD_LOGIC_5) U7.P16(VDD_LOGIC_6) U7.R12(VDD_LOGIC_7) U7.R16(VDD_LOGIC_8) U7.T12(VDD_LOGIC_9) U7.T16(VDD_LOGIC_10)
VDD_NPU: C103.2 C104.2 C105.2 C106.2 U7.M19(VDD_NPU_1) U7.N19(VDD_NPU_2) U7.P18(VDD_NPU_3) U7.P19(VDD_NPU_4) U7.P20(VDD_NPU_5)
VDD_CPU_COM: U7.M15(VDD_CPU_COM) ; port VDD_CPU_COM

### Notes on the sheet
- 此处电容不建议随意删减
- Drawn By :
- Checked By :
- Approved By :
- SheetNumber
- SheetTotal
- Revision :
- Time :
- Size :
- Date :
- A3
- DocumentName :
- Project :

### Library data of the parts
C86 C92-C94 C99-C101 C104-C106 = CAP_0603: Symbol: Capacitance; 3D Model: ac125912035d415993ca9572d50418b1; 3D Model Transform: 62.992,31.496,0,0,0,0,0,0,0; ConvertToPcb: yes; ModelName: C0603_L1.6-W0.8-H0.8; Device: CAP_0603; Value: 22uF; Supplier Footprint: 0603; AddInBom: yes; FootprintName: C0603
C87 C88 = CAP_0603: as C8 on sheet DCDC; Value: 22uF; Device: CAP_0603; AddInBom: yes; Supplier Footprint: 0603; FootprintName: C0603
C89 C90 C95-C97 C102 = MYC0402: C0402电容; Symbol: MY_C0201; AddInBom: yes; Device: MYC0402; ConvertToPcb: yes; FootprintName: MYC0402
  C89: Value: 100nF
  C90 C97 C102: Value: 4.7uF
  C95 C96: Value: 1uF
C91 C98 C103 = GRM035R60J475ME15D: 容值:4.7uF;精度:±20%;额定电压:6.3V;温度系数:X5R;; Manufacturer: muRata(村田); AddInBom: yes; ModelId: e8033a7cb35143ffb28e3b81b2577ea0; ModelName: C0201_L0.6-W0.3-H0.3; ModelTransform: 23.622,11.811,0,0,0,0,0,0,0; Tolerance: ±20%; Voltage Rating: 6.3V; Temperature Coefficient: X5R; Symbol: GRM035R60J475ME15D; Value: 0.1uF; Device: GRM035R60J475ME15D; LCSC Part Name: 4.7uF ±20% 6.3V; ManufacturerPart: GRM035R60J475ME15D; Supplier Footprint: 0201; JLCPCB Part Class: Extended Part; Datasheet: https://item.szlcsc.com/datasheet/GRM035R60J475ME15D/313624.html; Supplier: LCSC; ConvertToPcb: yes; FootprintName: C0201
U7 = RK3568: ConvertToPcb: yes; ModelId: e6756cba1b9f43448429fdcd1d44d9d9; ModelTransform: 748.03,748.03,54.33,0,0,0,0,0,0; Symbol: RK3568; Device: RK3568; AddInBom: yes; FootprintName: BGA-636_L19.0-W19.0-P0.65-BL; ModelName: BGA-636_L19.0-W19.0-P0.65-BL

## Sheet SOC_LOGIC.schdoc: =
size A3; Symbol: Sheet-Symbol_A4; Company: 嘉立创EDA; Version: V1.0; Page Size: A4; @Project Name: RK3568_LPD4X_120P_Core; @Page Count: 18; @Update Date: 2025-08-26; @Create Date: 2025-08-15; @Schematic Name: Schematic1; @Page No: 5; @Page Name: SOC_LOGIC; Device: Sheet-Symbol_A4; Border: 1; Title Block Position: 3; Width: 2338; Height: 1652; Region Start: 1; X Region Count: 6; Y Region Count: 4; Blade Width: 10; @Board Name: Board1; @Create Time: 13:45:16; @Update Time: 14:53:53; Organization: ORGANIZATION; Address1: ADDRESS 1; Address2: ADDRESS 2; Address3: ADDRESS 3; Address4: ADDRESS 4; Revision: V1.0.0; SheetNumber: 8; SheetTotal: 28
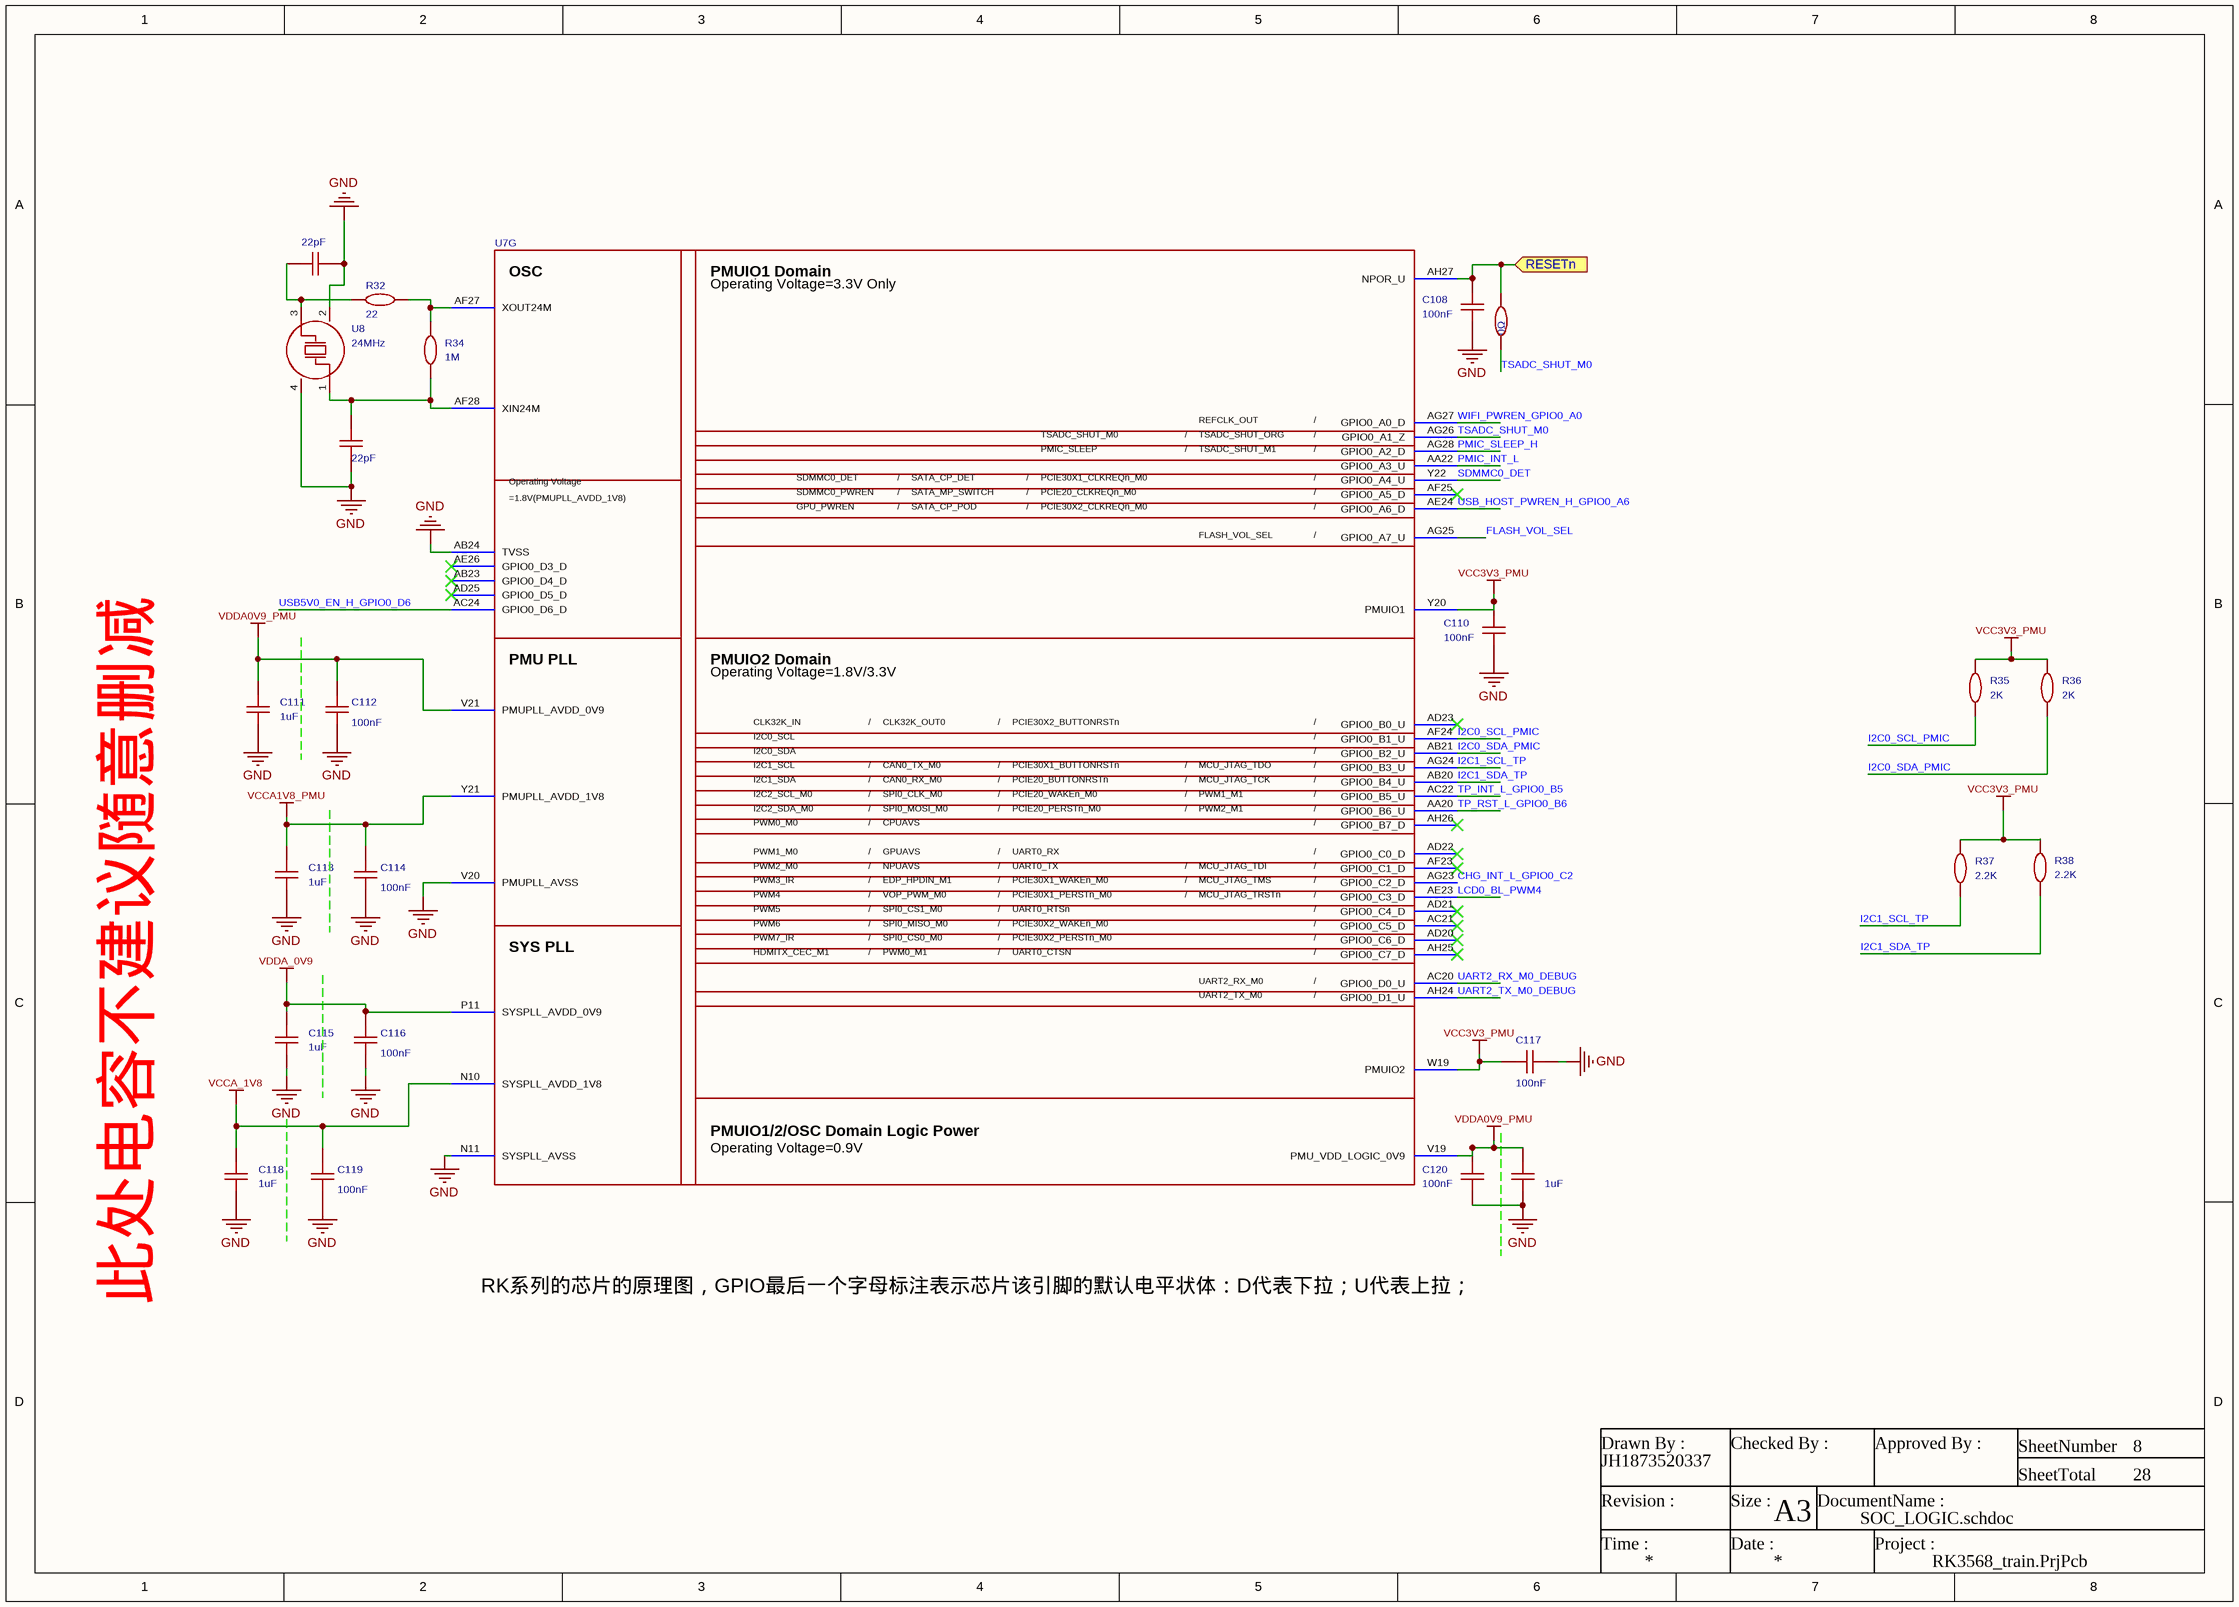
[diagram p7: SOC_LOGIC.schdoc]

### Parts
C107  value 22pF  [MYC0402]  (hidden comment: CL10C120JB8NNNC)
C108  100nF  [C0201]
C109  value 22pF  [MYC0402]  (hidden comment: CL10C120JB8NNNC)
C110  100nF  [C0201]
C111  value 1uF  [MYC0402]  (hidden comment: CL10A105KB8NNNC)
C112  100nF  [C0201]
C113  value 1uF  [MYC0402]  (hidden comment: CL10A105KB8NNNC)
C114  100nF  [C0201]
C115  value 1uF  [MYC0402]  (hidden comment: CL05B104KB54PNC)
C116  100nF  [C0201]
C117  100nF  [C0201]
C118  value 1uF  [MYC0402]  (hidden comment: CC0603KRX7R9BB104)
C119  100nF  [C0201]
C120  100nF  [C0201]
C121  value 1uF  [MYC0402]  (hidden comment: CL10A105KB8NNNC)
R32  22  [R0402]
R33  value 0Ω  [r0402-nsk]  (hidden comment: 0402WGF0000TCE)
R34  1M  [R0402]
R35  2K  [R0402]
R36  2K  [R0402]
R37  2.2K  [R0402]
R38  2.2K  [R0402]
U7  RK3568  [BGA-636_L19.0-W19.0-P0.65-BL]  (value not drawn)  (part G of 23)
U8  24MHz  [CRYSTAL-SMD_4P-L3.2-W2.5-BL]

### Ports
RESETn (in)

### Nets
GND: C107.2 C108.1 C109.1 C110.1 C111.1 C112.1 C113.1 C114.1 C115.1 C116.1 C117.1 C118.1 C119.1 C120.2 C121.1 U7.AB24(TVSS) U7.N11(SYSPLL_AVSS) U7.V20(PMUPLL_AVSS) U8.2(GND) U8.4(GND)
VCC3V3_PMU: C110.2 C117.2 R35.2 R36.2 R37.2 R38.2 U7.W19(PMUIO2) U7.Y20(PMUIO1)
VCCA1V8_PMU: C113.2 C114.2 U7.Y21(PMUPLL_AVDD_1V8)
VCCA_1V8: C118.2 C119.2 U7.N10(SYSPLL_AVDD_1V8)
VDDA0V9_PMU: C111.2 C112.2 C120.1 C121.2 U7.V19(PMU_VDD_LOGIC_0V9) U7.V21(PMUPLL_AVDD_0V9)
VDDA_0V9: C115.2 C116.2 U7.P11(SYSPLL_AVDD_0V9)
CHG_INT_L_GPIO0_C2: U7.AG23(GPIO0_C2_D)
FLASH_VOL_SEL: U7.AG25(GPIO0_A7_U)
I2C0_SCL_PMIC: R35.1 U7.AF24(GPIO0_B1_U)
I2C0_SDA_PMIC: R36.1 U7.AB21(GPIO0_B2_U)
I2C1_SCL_TP: R37.1 U7.AG24(GPIO0_B3_U)
I2C1_SDA_TP: R38.1 U7.AB20(GPIO0_B4_U)
LCD0_BL_PWM4: U7.AE23(GPIO0_C3_D)
PMIC_INT_L: U7.AA22(GPIO0_A3_U)
PMIC_SLEEP_H: U7.AG28(GPIO0_A2_D)
RESETn: C108.2 R33.2 U7.AH27(NPOR_U) ; port RESETn
SDMMC0_DET: U7.Y22(GPIO0_A4_U)
TP_INT_L_GPIO0_B5: U7.AC22(GPIO0_B5_U)  [project net TP_INT]
TP_RST_L_GPIO0_B6: U7.AA20(GPIO0_B6_U)  [project net TP_RST]
TSADC_SHUT_M0: R33.1 U7.AG26(GPIO0_A1_Z)
UART2_RX_M0_DEBUG: U7.AC20(GPIO0_D0_U)
UART2_TX_M0_DEBUG: U7.AH24(GPIO0_D1_U)
USB5V0_EN_H_GPIO0_D6: U7.AC24(GPIO0_D6_D)
USB_HOST_PWREN_H_GPIO0_A6: U7.AE24(GPIO0_A6_D)
WIFI_PWREN_GPIO0_A0: U7.AG27(GPIO0_A0_D)
NetC107_1: C107.1 R32.1 U8.3(OSC2)
NetC109_2: C109.2 R34.1 U7.AF28(XIN24M) U8.1(OSC1)
NetR32_2: R32.2 R34.2 U7.AF27(XOUT24M)

Not connected (* = marked no-connect by the designer): U7 AB23(GPIO0_D4_D)* AC21(GPIO0_C5_D)* AD20(GPIO0_C6_D)* AD21(GPIO0_C4_D)* AD22(GPIO0_C0_D)* AD23(GPIO0_B0_U)* AD25(GPIO0_D5_D)* AE26(GPIO0_D3_D)* AF23(GPIO0_C1_D)* AF25(GPIO0_A5_D)* AH25(GPIO0_C7_D)* AH26(GPIO0_B7_D)*

### Notes on the sheet
- 此处电容不建议随意删减
- RK系列的芯片的原理图，GPIO最后一个字母标注表示芯片该引脚的默认电平状体：D代表下拉；U代表上拉；
- Drawn By :
- Checked By :
- Approved By :
- SheetNumber
- SheetTotal
- Revision :
- Time :
- Size :
- Date :
- A3
- DocumentName :
- Project :
- (in symbol RK3568, part G) OSC; PMUIO1 Domain; Operating Voltage=3.3V Only; REFCLK_OUT; /; TSADC_SHUT_M0; TSADC_SHUT_ORG; PMIC_SLEEP; TSADC_SHUT_M1; Operating Voltage; SDMMC0_DET; SATA_CP_DET; PCIE30X1_CLKREQn_M0; SDMMC0_PWREN; SATA_MP_SWITCH; PCIE20_CLKREQn_M0; GPU_PWREN; SATA_CP_POD; PCIE30X2_CLKREQn_M0; FLASH_VOL_SEL; PMU PLL; PMUIO2 Domain; Operating Voltage=1.8V/3.3V; CLK32K_IN; CLK32K_OUT0; PCIE30X2_BUTTONRSTn; I2C0_SCL; I2C0_SDA; I2C1_SCL; CAN0_TX_M0; PCIE30X1_BUTTONRSTn; MCU_JTAG_TDO; I2C1_SDA; CAN0_RX_M0; PCIE20_BUTTONRSTn; MCU_JTAG_TCK; I2C2_SCL_M0; SPI0_CLK_M0; PCIE20_WAKEn_M0; PWM1_M1; I2C2_SDA_M0; SPI0_MOSI_M0; PCIE20_PERSTn_M0; PWM2_M1; PWM0_M0; CPUAVS; PWM1_M0; GPUAVS; UART0_RX; PWM2_M0; NPUAVS; UART0_TX; MCU_JTAG_TDI; PWM3_IR; EDP_HPDIN_M1; PCIE30X1_WAKEn_M0; MCU_JTAG_TMS; PWM4; VOP_PWM_M0; PCIE30X1_PERSTn_M0; MCU_JTAG_TRSTn; PWM5; SPI0_CS1_M0; UART0_RTSn; PWM6; SPI0_MISO_M0; PCIE30X2_WAKEn_M0; PWM7_IR; SPI0_CS0_M0; PCIE30X2_PERSTn_M0; SYS PLL; HDMITX_CEC_M1; PWM0_M1; UART0_CTSN; UART2_RX_M0; UART2_TX_M0; PMUIO1/2/OSC Domain Logic Power; Operating Voltage=0.9V

### Library data of the parts
C107 C109 = CL10C120JB8NNNC: 容值:12pF;精度:±5%;额定电压:50V;材质(温度系数):C0G;; Manufacturer: SAMSUNG(三星); Symbol: CapAcitance; AddInBom: yes; ModelId: ac125912035d415993ca9572d50418b1; ModelName: C0603_L1.6-W0.8-H0.8; ModelTransform: 62.992,31.496,0,0,0,0,0,0,0; Tolerance: ±5%; Voltage Rated: 50V; Temperature Coefficient: C0G; Device: CL10C120JB8NNNC; LCSC Part Name: 12pF ±5% 50V; ManufacturerPart: CL10C120JB8NNNC; Supplier Footprint: 0603; JLCPCB Part Class: Basic Part; Datasheet: https://atta.szlcsc.com/upload/public/pdf/source/20160218/1457707763339.pdf; Supplier: LCSC; ConvertToPcb: yes; FootprintName: MYC0402
C108 C110 C112 C114 C116 C117 C119 C120 = GRM035R60J475ME15D: as C91 on sheet SOC_PWR; Symbol: GRM035R60J475ME15D; Value: 100nF; Device: GRM035R60J475ME15D; LCSC Part Name: 4.7uF ±20% 6.3V; ManufacturerPart: GRM035R60J475ME15D; Supplier Footprint: 0201; JLCPCB Part Class: Extended Part; Datasheet: https://item.szlcsc.com/datasheet/GRM035R60J475ME15D/313624.html; Supplier: LCSC; ConvertToPcb: yes; FootprintName: C0201
C111 C113 = CL10A105KB8NNNC: 容值:1uF;精度:±10%;额定电压:50V;材质(温度系数):X5R;; Manufacturer: SAMSUNG(三星); Symbol: CapAcitance; AddInBom: yes; ModelId: ac125912035d415993ca9572d50418b1; ModelName: C0603_L1.6-W0.8-H0.8; ModelTransform: 62.992,31.496,0,0,0,0,0,0,0; Tolerance: ±10%; Voltage Rated: 50V; Temperature Coefficient: X5R; Device: CL10A105KB8NNNC; LCSC Part Name: 1uF ±10% 50V; SupplierPart: C15849; ManufacturerPart: CL10A105KB8NNNC; Supplier Footprint: 0603; JLCPCB Part Class: Basic Part; Datasheet: https://atta.szlcsc.com/upload/public/pdf/source/20160103/1457707679084.pdf; Supplier: LCSC; ConvertToPcb: yes; FootprintName: MYC0402
C115 = CL05B104KB54PNC: 容值:100nF;精度:±10%;额定电压:50V;材质(温度系数):X7R;; Manufacturer: SAMSUNG(三星); Symbol: CapAcitance; 3D Model: ac125912035d415993ca9572d50418b1; AddInBom: yes; ModelName: C0402_L1.0-W0.5-H0.5; ModelTransform: 39.37,19.685,0,0,0,0,0,0,0; Tolerance: ±10%; Voltage Rated: 50V; Temperature Coefficient: X7R; Device: CL05B104KB54PNC; LCSC Part Name: 100nF ±10% 50V; ManufacturerPart: CL05B104KB54PNC; Supplier Footprint: 0402; JLCPCB Part Class: Basic Part; Datasheet: https://atta.szlcsc.com/upload/public/pdf/source/20181009/C307331_222F7C870FD3EA5F46F538B483443886.pdf; Supplier: LCSC; ConvertToPcb: yes; FootprintName: MYC0402
C118 = CC0603KRX7R9BB104: as C3 on sheet DCDC; Device: CC0603KRX7R9BB104; LCSC Part Name: 100nF ±10% 50V; ManufacturerPart: CC0603KRX7R9BB104; Supplier Footprint: 0603; JLCPCB Part Class: Basic Part; Datasheet: https://atta.szlcsc.com/upload/public/pdf/source/20180910/C282072_33301C7F631E79921B82A8DAC6BCC5B3.pdf; Supplier: LCSC; ConvertToPcb: yes; FootprintName: MYC0402
C121 = CL10A105KB8NNNC: 容值:1uF;精度:±10%;额定电压:50V;材质(温度系数):X5R;; Manufacturer: SAMSUNG(三星); Symbol: CapAcitance; 3D Model: 36a51122f27c49738f86b3bfa98863e0; AddInBom: yes; ModelName: C0603_L1.6-W0.8-H0.8; ModelTransform: 62.992,31.496,0,0,0,0,0,0,0; Tolerance: ±10%; Voltage Rated: 50V; Temperature Coefficient: X5R; Device: CL10A105KB8NNNC; LCSC Part Name: 1uF ±10% 50V; SupplierPart: C15849; ManufacturerPart: CL10A105KB8NNNC; Supplier Footprint: 0603; JLCPCB Part Class: Basic Part; Datasheet: https://atta.szlcsc.com/upload/public/pdf/source/20160103/1457707679084.pdf; Supplier: LCSC; ConvertToPcb: yes; FootprintName: MYC0402
R32 R34-R38 = Res_0402: as R1 on sheet DCDC; Device: Res_0402; AddInBom: yes; Supplier Footprint: 0402; FootprintName: R0402
  R32: Value: 22
  R34: Value: 1M
  R35 R36: Value: 2K
  R37 R38: Value: 2.2K
R33 = 0402WGF0000TCE: 电阻类型:厚膜电阻;阻值:0Ω;精度:±1%;功率:62.5mW;; Manufacturer: UNI-ROYAL(厚声); Symbol: 电阻; AddInBom: yes; ModelId: 671aefced39d4c318694bba8bd8efd39; ModelName: R0402_L1.0-W0.5-H0.5; ModelTransform: 39.37,19.685,0,0,0,0,0,0.0005,0; Tolerance: ±1%; Power(Watts): 62.5mW; Temperature Coefficient: ±800ppm/℃; Overload Voltage (Max): 50V; Device: 0402WGF0000TCE; LCSC Part Name: 0Ω ±1% 62.5mW; SupplierPart: C17168; ManufacturerPart: 0402WGF0000TCE; Supplier Footprint: 0402; JLCPCB Part Class: Basic Part; Datasheet: https://atta.szlcsc.com/upload/public/pdf/source/20200306/C422600_1E6D84923E4A46A82E41ADD87F860B5C.pdf; Supplier: LCSC; ConvertToPcb: yes; FootprintName: r0402-nsk; Type: 厚膜电阻; Operating Temperature Range: -55℃~+155℃
U7 = RK3568: as U7 on sheet SOC_PWR; Symbol: RK3568; Device: RK3568; AddInBom: yes; FootprintName: BGA-636_L19.0-W19.0-P0.65-BL; ModelName: BGA-636_L19.0-W19.0-P0.65-BL
U8 = 3225 24M 12PF 10PPM: 频率:24MHz;常温频差:±10ppm;外接负载电容:12pF;频率稳定度(全温):±30ppm;; Manufacturer: SST(索斯特); AddInBom: yes; ModelId: 1840cb1b89674ca18acb69eedbab271b; ModelName: OSC-SMD_4P-L3.2-W2.5-H1.0; ModelTransform: 125.984,98.425,0,0,0,0,0,0,0; Normal temperature Frequency Tolerance: ±10ppm; External load capacitor: 12pF; Frequency Stability(Full temperature range): ±30ppm; Symbol: 3225 24M 12PF 10PPM; Device: 3225 24M 12PF 10PPM; LCSC Part Name: 24MHz ±10ppm 12pF; SupplierPart: C5181479; ManufacturerPart: 3225 24M 12PF 10PPM; Supplier Footprint: SMD3225-4P; JLCPCB Part Class: 扩展库; Datasheet: https://atta.szlcsc.com/upload/public/pdf/source/20220927/6DE882D78314C64B49594C58A0BA2E52.pdf; Supplier: LCSC; ConvertToPcb: yes; FootprintName: CRYSTAL-SMD_4P-L3.2-W2.5-BL; Value: 24MHz; Operating Temperature: -20℃~+70℃

## Sheet SOC_CAM.schdoc: =
size A4; Symbol: Sheet-Symbol_A4; Company: 嘉立创EDA; Version: V1.0; Page Size: A4; @Project Name: RK3568_LPD4X_120P_Core; @Page Count: 17; @Update Date: 2025-08-22; @Create Date: 2025-08-15; @Schematic Name: Schematic1; @Page No: 11; @Page Name: SOC_CAM; Device: Sheet-Symbol_A4; Border: 1; Title Block Position: 3; Width: 1170; Height: 825; Region Start: 1; X Region Count: 6; Y Region Count: 4; Blade Width: 10; @Board Name: Board1; @Create Time: 15:05:23; @Update Time: 14:34:19; Organization: ORGANIZATION; Address1: ADDRESS 1; Address2: ADDRESS 2; Address3: ADDRESS 3; Address4: ADDRESS 4; Revision: V1.0.0; SheetNumber: 9; SheetTotal: 28
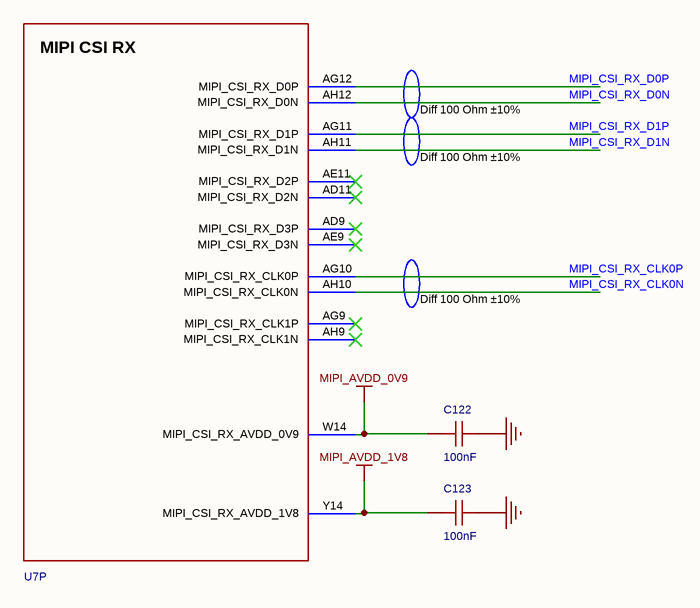
[diagram p8: SOC_CAM.schdoc]

### Parts
C122  100nF  [C0201]
C123  100nF  [C0201]
U7  RK3568  [BGA-636_L19.0-W19.0-P0.65-BL]  (value not drawn)  (part P of 23)

### Nets
GND: C122.1 C123.1
MIPI_AVDD_0V9: C122.2 U7.W14(MIPI_CSI_RX_AVDD_0V9)
MIPI_AVDD_1V8: C123.2 U7.Y14(MIPI_CSI_RX_AVDD_1V8)
MIPI_CSI_RX_CLK0N: U7.AH10(MIPI_CSI_RX_CLK0N)  [project net CAM0_CKN]
MIPI_CSI_RX_CLK0P: U7.AG10(MIPI_CSI_RX_CLK0P)  [project net CAM0_CKP]
MIPI_CSI_RX_D0N: U7.AH12(MIPI_CSI_RX_D0N)  [project net CAM0_DN0]
MIPI_CSI_RX_D0P: U7.AG12(MIPI_CSI_RX_D0P)  [project net CAM0_DP0]
MIPI_CSI_RX_D1N: U7.AH11(MIPI_CSI_RX_D1N)  [project net CAM0_DN1]
MIPI_CSI_RX_D1P: U7.AG11(MIPI_CSI_RX_D1P)  [project net CAM0_DP1]

Not connected (* = marked no-connect by the designer): U7 AD9(MIPI_CSI_RX_D3P)* AD11(MIPI_CSI_RX_D2N)* AE9(MIPI_CSI_RX_D3N)* AE11(MIPI_CSI_RX_D2P)* AG9(MIPI_CSI_RX_CLK1P)* AH9(MIPI_CSI_RX_CLK1N)*

### Notes on the sheet
- Diff 100 Ohm ±10%
- Drawn By :
- Checked By :
- Approved By :
- SheetNumber
- SheetTotal
- Revision :
- Time :
- Size :
- Date :
- A4
- DocumentName :
- Project :
- (in symbol RK3568, part P) MIPI CSI RX

### Library data of the parts
C122 C123 = GRM035R60J475ME15D: as C91 on sheet SOC_PWR; Symbol: GRM035R60J475ME15D; Value: 100nF; Device: GRM035R60J475ME15D; LCSC Part Name: 4.7uF ±20% 6.3V; ManufacturerPart: GRM035R60J475ME15D; Supplier Footprint: 0201; JLCPCB Part Class: Extended Part; Datasheet: https://item.szlcsc.com/datasheet/GRM035R60J475ME15D/313624.html; Supplier: LCSC; ConvertToPcb: yes; FootprintName: C0201
U7 = RK3568: as U7 on sheet SOC_PWR; Symbol: RK3568; Device: RK3568; AddInBom: yes; FootprintName: BGA-636_L19.0-W19.0-P0.65-BL; ModelName: BGA-636_L19.0-W19.0-P0.65-BL